# EAGLE design dc26-dev-board (EAGLE 8.6.0)

## Sheet 1 of 7
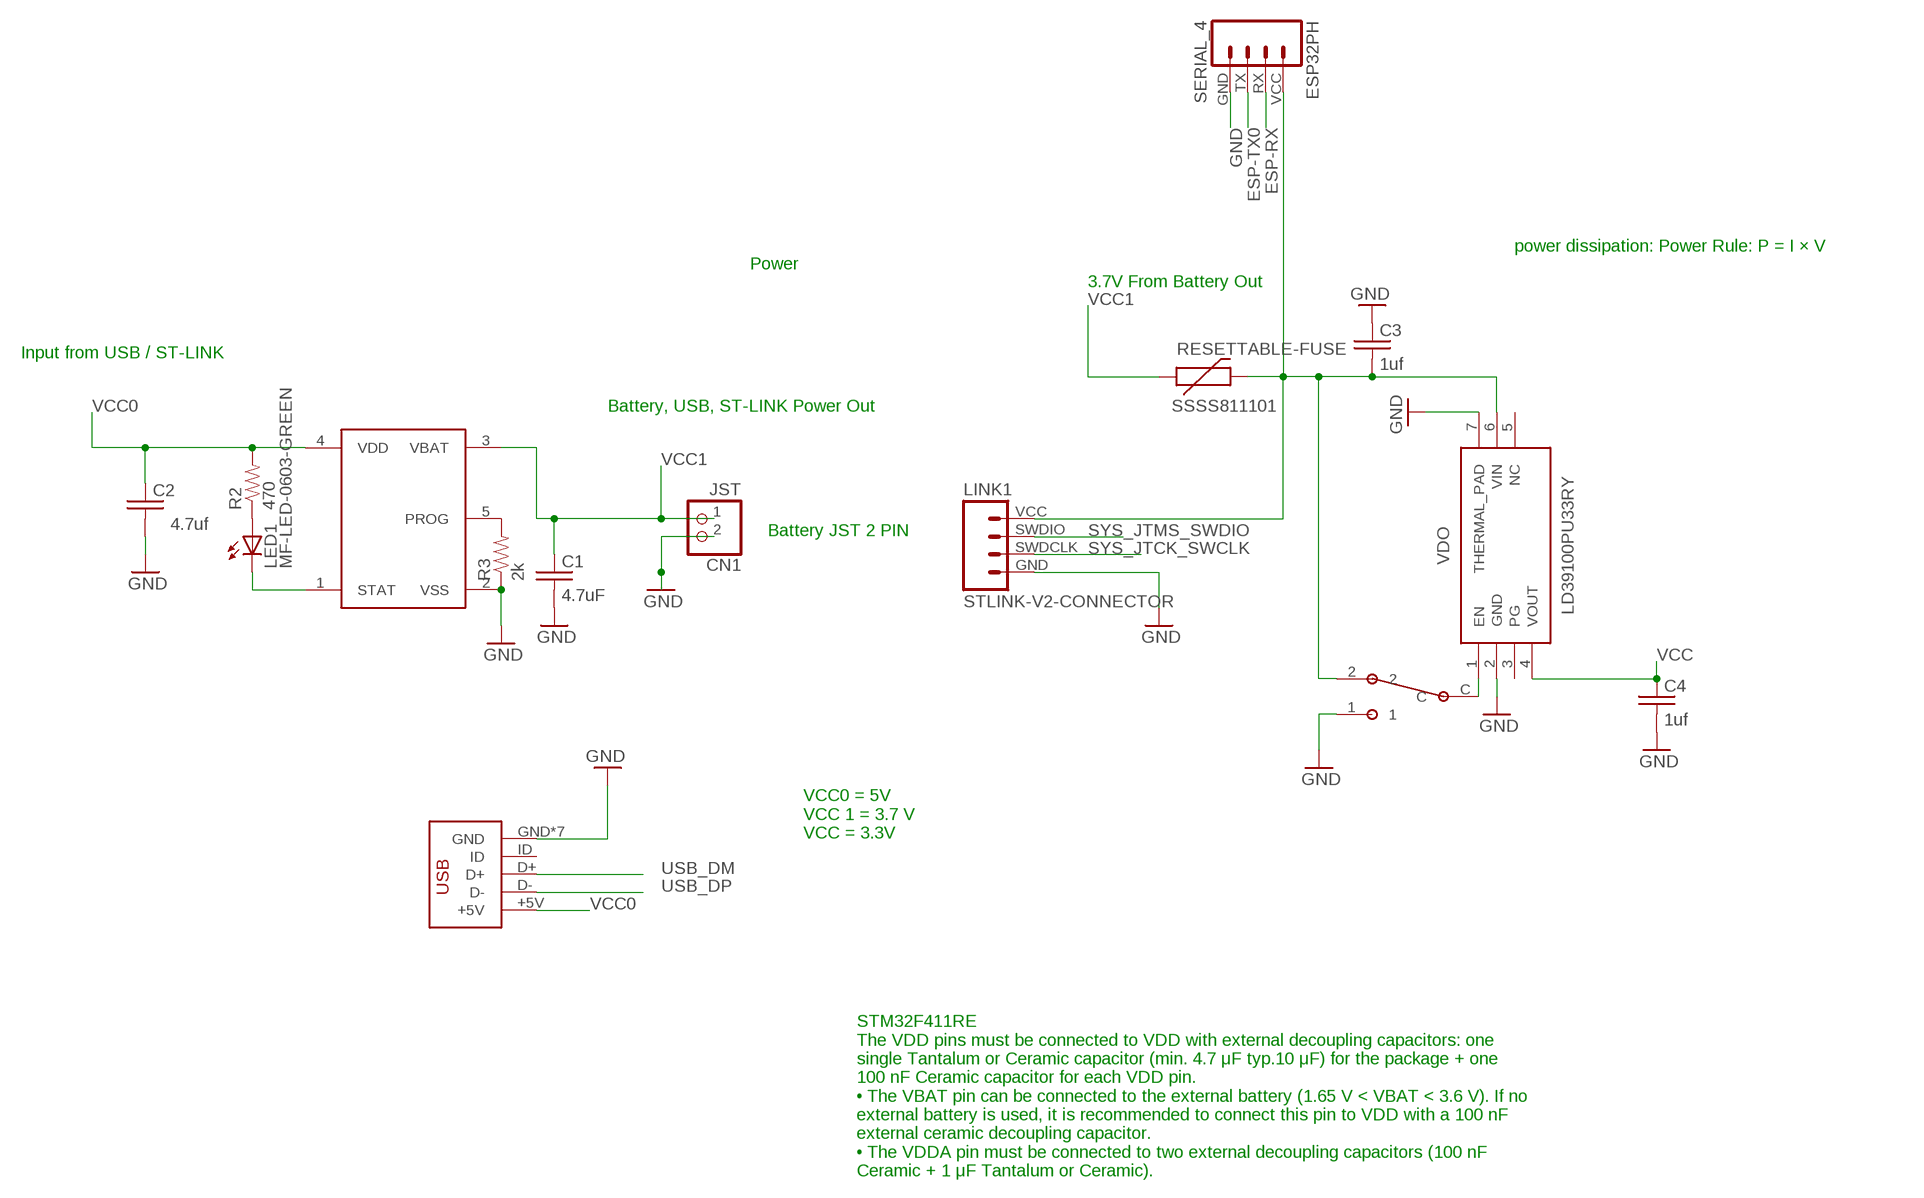
[diagram p0: schematic, sheet 1]

### Parts
C1  4.7uF  C-USC0805  [C0805]
C2  4.7uf  C-USC0805  [C0805]
C3  1uf  C-USC0805  [C0805]
C4  1uf  C-USC0805  [C0805]
CHARGING_CIRCUT  MCP73831  DS21984E  [SOT23-5]
CN1  JST  JST_2PIN-THM-RA  [JST-PH-2-THM-RA]
ESP32PH  SERIAL_4  [SERIAL_HEADER_4]
LED1  MF-LED-0603-GREEN  LED1206  [LED-1206]
LINK1  STLINK-V2-CONNECTOR  [1X04]
P1  SSSS811101  SWITCH_SPDT  [SPDT_SSAJ120100]
R2  470  RESISTOR0805-RES  [0805]
R3  2k  RESISTOR0805-RES  [0805]
RESETTABLE-FUSE  SSSS811101  PTCSMD  [PTC-1206]
USB  DX4R005JJ2DX4R005JJ2  [DX4R005JJ2]
VDO  LD39100PU33RY  [SON95P300X300X90-7N]

### Nets
ESP-RX: ESP32PH.RX ; also sheet 4
ESP-TX0: ESP32PH.TX ; also sheet 4
GND: C1.2 C2.2 C3.1 C4.2 CHARGING_CIRCUT.2(VSS) CN1.2 ESP32PH.GND LINK1.GND P1.1 R3.1 USB.GND USB.P$6(GND) USB.P$7(GND) USB.P$8(GND) USB.P$9(GND) USB.P$10(GND) USB.P$11(GND) VDO.2(GND) VDO.7(THERMAL_PAD) ; also sheet 2,3,4,5
N$1: LED1.A R2.1
N$2: CHARGING_CIRCUT.5(PROG) R3.2
N$3: CHARGING_CIRCUT.1(STAT) LED1.C
SYS_JTCK_SWCLK: LINK1.SWDCLK ; also sheet 2
SYS_JTMS_SWDIO: LINK1.SWDIO ; also sheet 2
USB_DM: USB.D+ ; also sheet 2
USB_DP: USB.D- ; also sheet 2
VCC: C4.1 VDO.4(VOUT) ; also sheet 2,4,5
VCC0: C2.1 CHARGING_CIRCUT.4(VDD) R2.2 USB.+5V
VCC1: C1.1 CHARGING_CIRCUT.3(VBAT) CN1.1 RESETTABLE-FUSE.1 ; also sheet 3
VIN: C3.2 ESP32PH.VCC LINK1.VCC P1.2 RESETTABLE-FUSE.2 VDO.6(VIN)
VIN-EN: P1.C VDO.1(EN)
Unconnected: USB.ID VDO.3(PG) VDO.5(NC)

### Notes on the sheet
- power dissipation: Power Rule: P = I × V
- Power
- 3.7V From Battery Out
- Input from USB / ST-LINK
- Battery, USB, ST-LINK Power Out
- Battery JST 2 PIN
- VCC0 = 5V
  VCC 1 = 3.7 V
  VCC = 3.3V
- STM32F411RE
  The VDD pins must be connected to VDD with external decoupling capacitors: one
  single Tantalum or Ceramic capacitor (min. 4.7 μF typ.10 μF) for the package + one
  100 nF Ceramic capacitor for each VDD pin.
  • The VBAT pin can be connected to the external battery (1.65 V < VBAT < 3.6 V). If no
  external battery is used, it is recommended to connect this pin to VDD with a 100 nF
  external ceramic decoupling capacitor.
  • The VDDA pin must be connected to two external decoupling capacitors (100 nF
  Ceramic + 1 μF Tantalum or Ceramic).

## Sheet 2 of 7
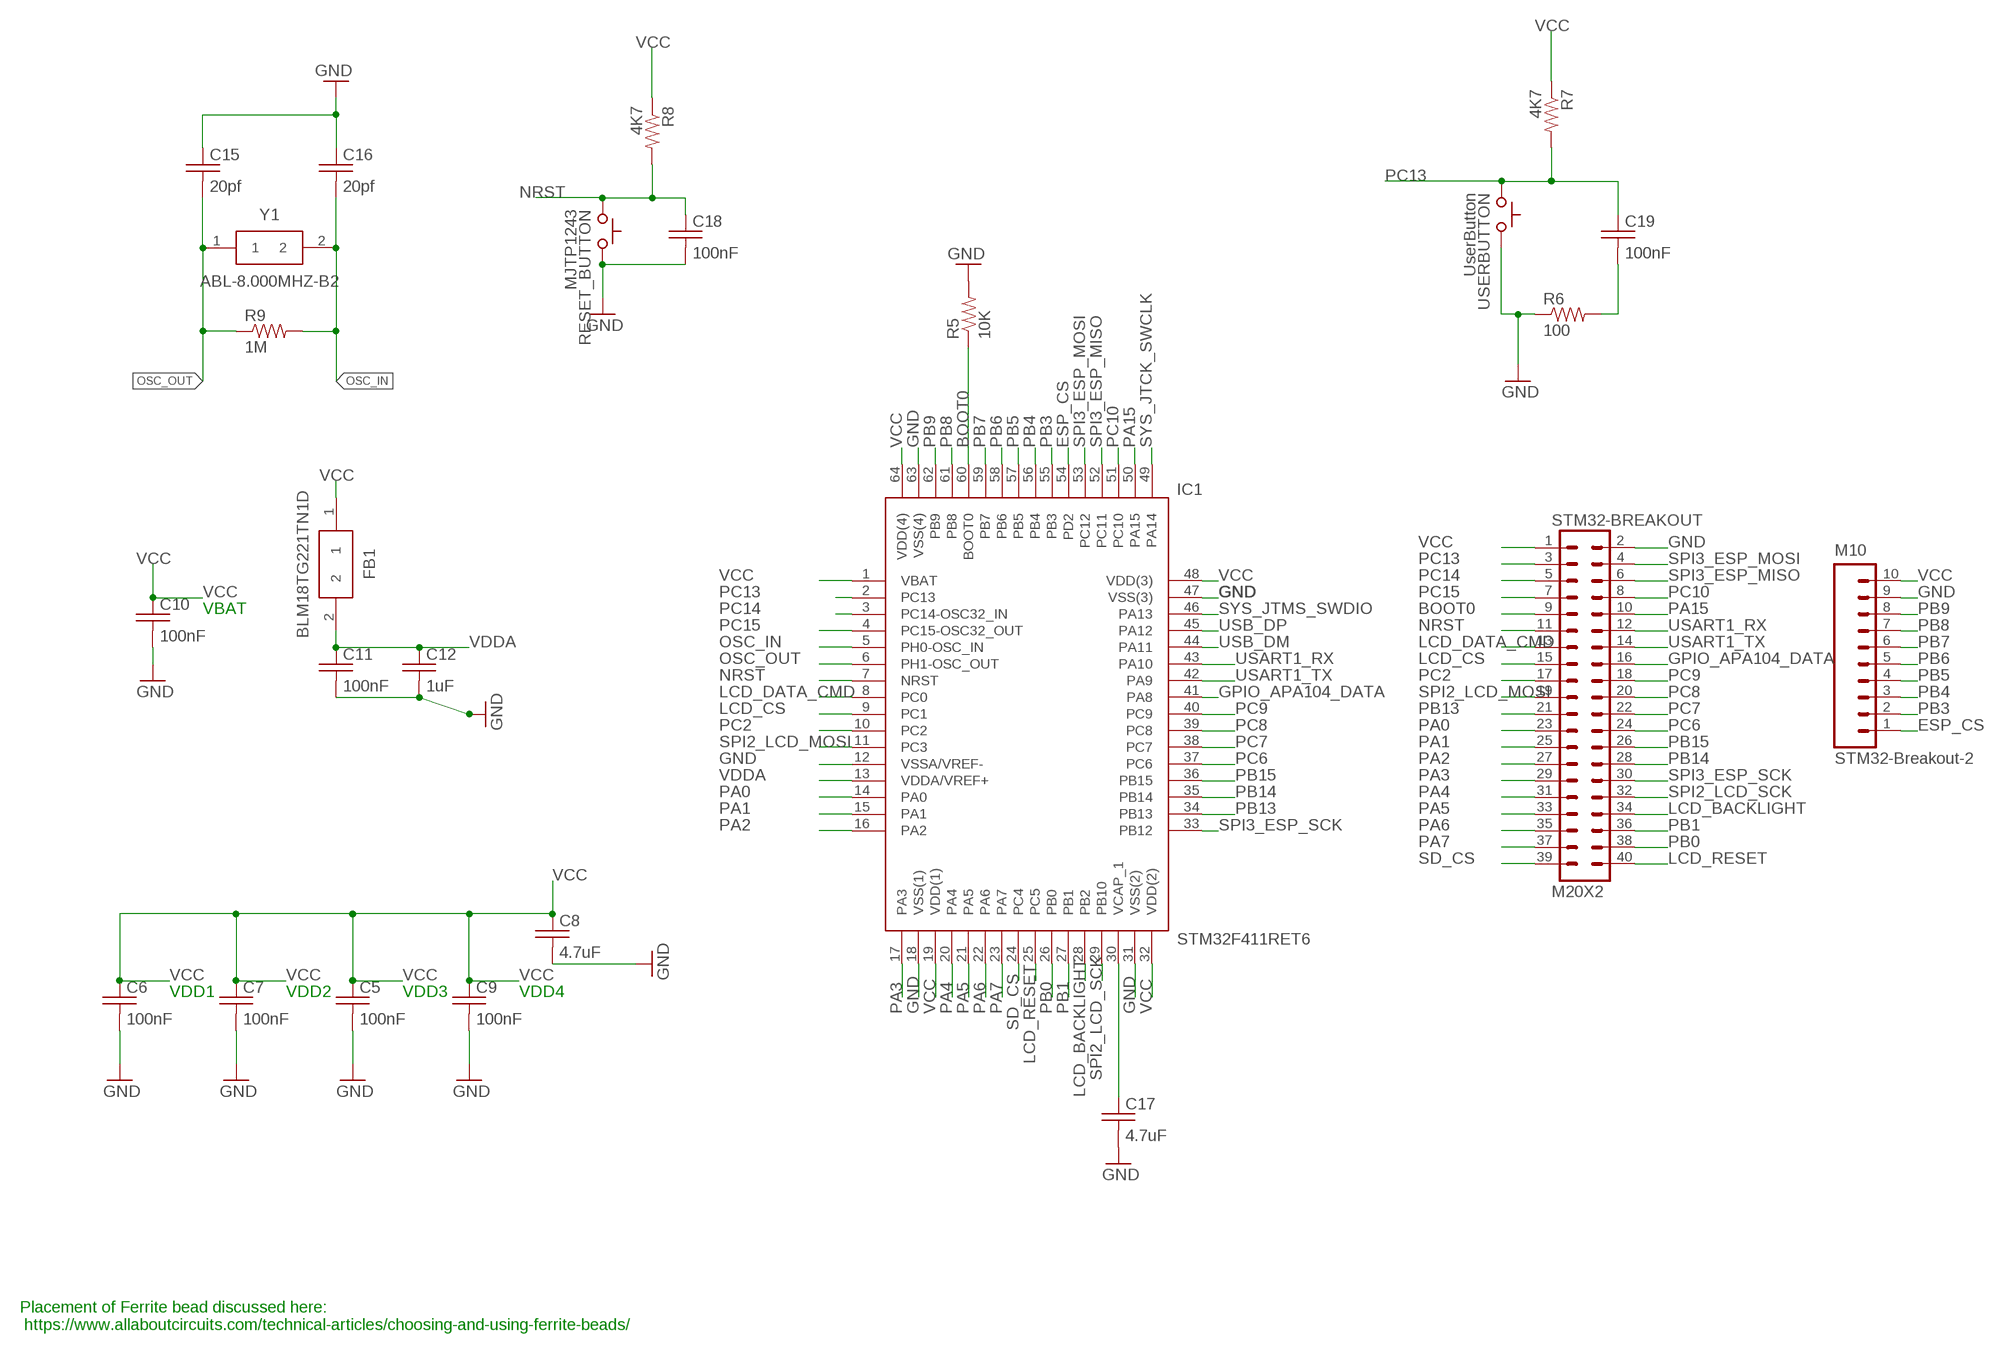
[diagram p1: schematic, sheet 2]

### Parts
C5  100nF  C-USC0805  [C0805]
C6  100nF  C-USC0805  [C0805]
C7  100nF  C-USC0805  [C0805]
C8  4.7uF  C-USC0805  [C0805]
C9  100nF  C-USC0805  [C0805]
C10  100nF  C-USC0805  [C0805]
C11  100nF  C-USC0805  [C0805]
C12  1uF  C-USC0805  [C0805]
C15  20pf  C-USC0805  [C0805]
C16  20pf  C-USC0805  [C0805]
C17  4.7uF  C-USC0805  [C0805]
C18  100nF  C-USC0805  [C0805]
C19  100nF  C-USC0805  [C0805]
FB1  BLM18TG221TN1D  [BEADC1608X75N]
IC1  STM32F411RET6  [QFP50P1200X1200X160-64N]
M10  STM32-Breakout-2  M10SILK_FEMALE_PTH  [1X10]
R5  10K  RESISTOR0805-RES  [0805]
R6  100  RESISTOR0805-RES  [0805]
R7  4K7  RESISTOR0805-RES  [0805]
R8  4K7  RESISTOR0805-RES  [0805]
R9  1M  RESISTOR0805-RES  [0805]
RESET_BUTTON  MJTP1243  SWITCH_TACTILETACTILE-2PIN-NARROW  [TACTILE-2PIN-NARROW]
STM32-BREAKOUT  M20X2  [2X20]
USERBUTTON  UserButton  SWITCH_TACTILETACTILE-2PIN-NARROW  [TACTILE-2PIN-NARROW]
Y1  ABL-8.000MHZ-B2  [HC/49US_(AT49)PTH]

### Nets
BOOT0: IC1.60(BOOT0) R5.1 STM32-BREAKOUT.9
ESP_CS: IC1.54(PD2) M10.1 ; also sheet 4
GND: C5.2 C6.2 C7.2 C8.2 C9.2 C10.2 C11.2 C12.2 C15.1 C16.1 C17.2 C18.2 IC1.12(VSSA/VREF-) IC1.18(VSS(1)) IC1.31(VSS(2)) IC1.47(VSS(3)) IC1.63(VSS(4)) M10.9 R5.2 R6.1 RESET_BUTTON.P$1(A) STM32-BREAKOUT.2 USERBUTTON.P$1(A) ; also sheet 1,3,4,5
GPIO_APA104_DATA: IC1.41(PA8) STM32-BREAKOUT.16 ; also sheet 3
LCD_BACKLIGHT: IC1.28(PB2) STM32-BREAKOUT.34 ; also sheet 5
LCD_CS: IC1.9(PC1) STM32-BREAKOUT.15 ; also sheet 5
LCD_DATA_CMD: IC1.8(PC0) STM32-BREAKOUT.13 ; also sheet 5
LCD_RESET: IC1.25(PC5) STM32-BREAKOUT.40 ; also sheet 5
N$4: C19.2 R6.2
N$20: C17.1 IC1.30(VCAP_1)
NRST: C18.1 IC1.7(NRST) R8.2 RESET_BUTTON.P$2(C) STM32-BREAKOUT.11
OSC_IN: C16.2 IC1.5(PH0-OSC_IN) R9.2 Y1.2
OSC_OUT: C15.2 IC1.6(PH1-OSC_OUT) R9.1 Y1.1
PA0: IC1.14(PA0) STM32-BREAKOUT.23
PA1: IC1.15(PA1) STM32-BREAKOUT.25
PA2: IC1.16(PA2) STM32-BREAKOUT.27
PA3: IC1.17(PA3) STM32-BREAKOUT.29
PA4: IC1.20(PA4) STM32-BREAKOUT.31
PA5: IC1.21(PA5) STM32-BREAKOUT.33
PA6: IC1.22(PA6) STM32-BREAKOUT.35
PA7: IC1.23(PA7) STM32-BREAKOUT.37
PA15: IC1.50(PA15) STM32-BREAKOUT.10
PB0: IC1.26(PB0) STM32-BREAKOUT.38
PB1: IC1.27(PB1) STM32-BREAKOUT.36
PB3: IC1.55(PB3) M10.2
PB4: IC1.56(PB4) M10.3
PB5: IC1.57(PB5) M10.4
PB6: IC1.58(PB6) M10.5
PB7: IC1.59(PB7) M10.6
PB8: IC1.61(PB8) M10.7
PB9: IC1.62(PB9) M10.8
PB13: IC1.34(PB13) STM32-BREAKOUT.21
PB14: IC1.35(PB14) STM32-BREAKOUT.28
PB15: IC1.36(PB15) STM32-BREAKOUT.26
PC2: IC1.10(PC2) STM32-BREAKOUT.17
PC6: IC1.37(PC6) STM32-BREAKOUT.24
PC7: IC1.38(PC7) STM32-BREAKOUT.22
PC8: IC1.39(PC8) STM32-BREAKOUT.20
PC9: IC1.40(PC9) STM32-BREAKOUT.18
PC10: IC1.51(PC10) STM32-BREAKOUT.8
PC13: C19.1 IC1.2(PC13) R7.2 STM32-BREAKOUT.3 USERBUTTON.P$2(C)
PC14: IC1.3(PC14-OSC32_IN) STM32-BREAKOUT.5
PC15: IC1.4(PC15-OSC32_OUT) STM32-BREAKOUT.7
SD_CS: IC1.24(PC4) STM32-BREAKOUT.39 ; also sheet 5
SPI2_LCD_MOSI: IC1.11(PC3) STM32-BREAKOUT.19 ; also sheet 5
SPI2_LCD_SCK: IC1.29(PB10) STM32-BREAKOUT.32 ; also sheet 5
SPI3_ESP_MISO: IC1.52(PC11) STM32-BREAKOUT.6 ; also sheet 4,5
SPI3_ESP_MOSI: IC1.53(PC12) STM32-BREAKOUT.4 ; also sheet 4,5
SPI3_ESP_SCK: IC1.33(PB12) STM32-BREAKOUT.30 ; also sheet 4,5
SYS_JTCK_SWCLK: IC1.49(PA14) ; also sheet 1
SYS_JTMS_SWDIO: IC1.46(PA13) ; also sheet 1
USART1_RX: IC1.43(PA10) STM32-BREAKOUT.12
USART1_TX: IC1.42(PA9) STM32-BREAKOUT.14
USB_DM: IC1.44(PA11) ; also sheet 1
USB_DP: IC1.45(PA12) ; also sheet 1
VCC: C5.1 C6.1 C7.1 C8.1 C9.1 C10.1 FB1.1 IC1.1(VBAT) IC1.19(VDD(1)) IC1.32(VDD(2)) IC1.48(VDD(3)) IC1.64(VDD(4)) M10.10 R7.1 R8.1 STM32-BREAKOUT.1 ; also sheet 1,4,5
VDDA: C11.1 C12.1 FB1.2 IC1.13(VDDA/VREF+)

### Notes on the sheet
- VBAT
- VDD1 | VDD2 | VDD3 | VDD4
- Placement of Ferrite bead discussed here: 
   https://www.allaboutcircuits.com/technical-articles/choosing-and-using-ferrite-beads/

## Sheet 3 of 7
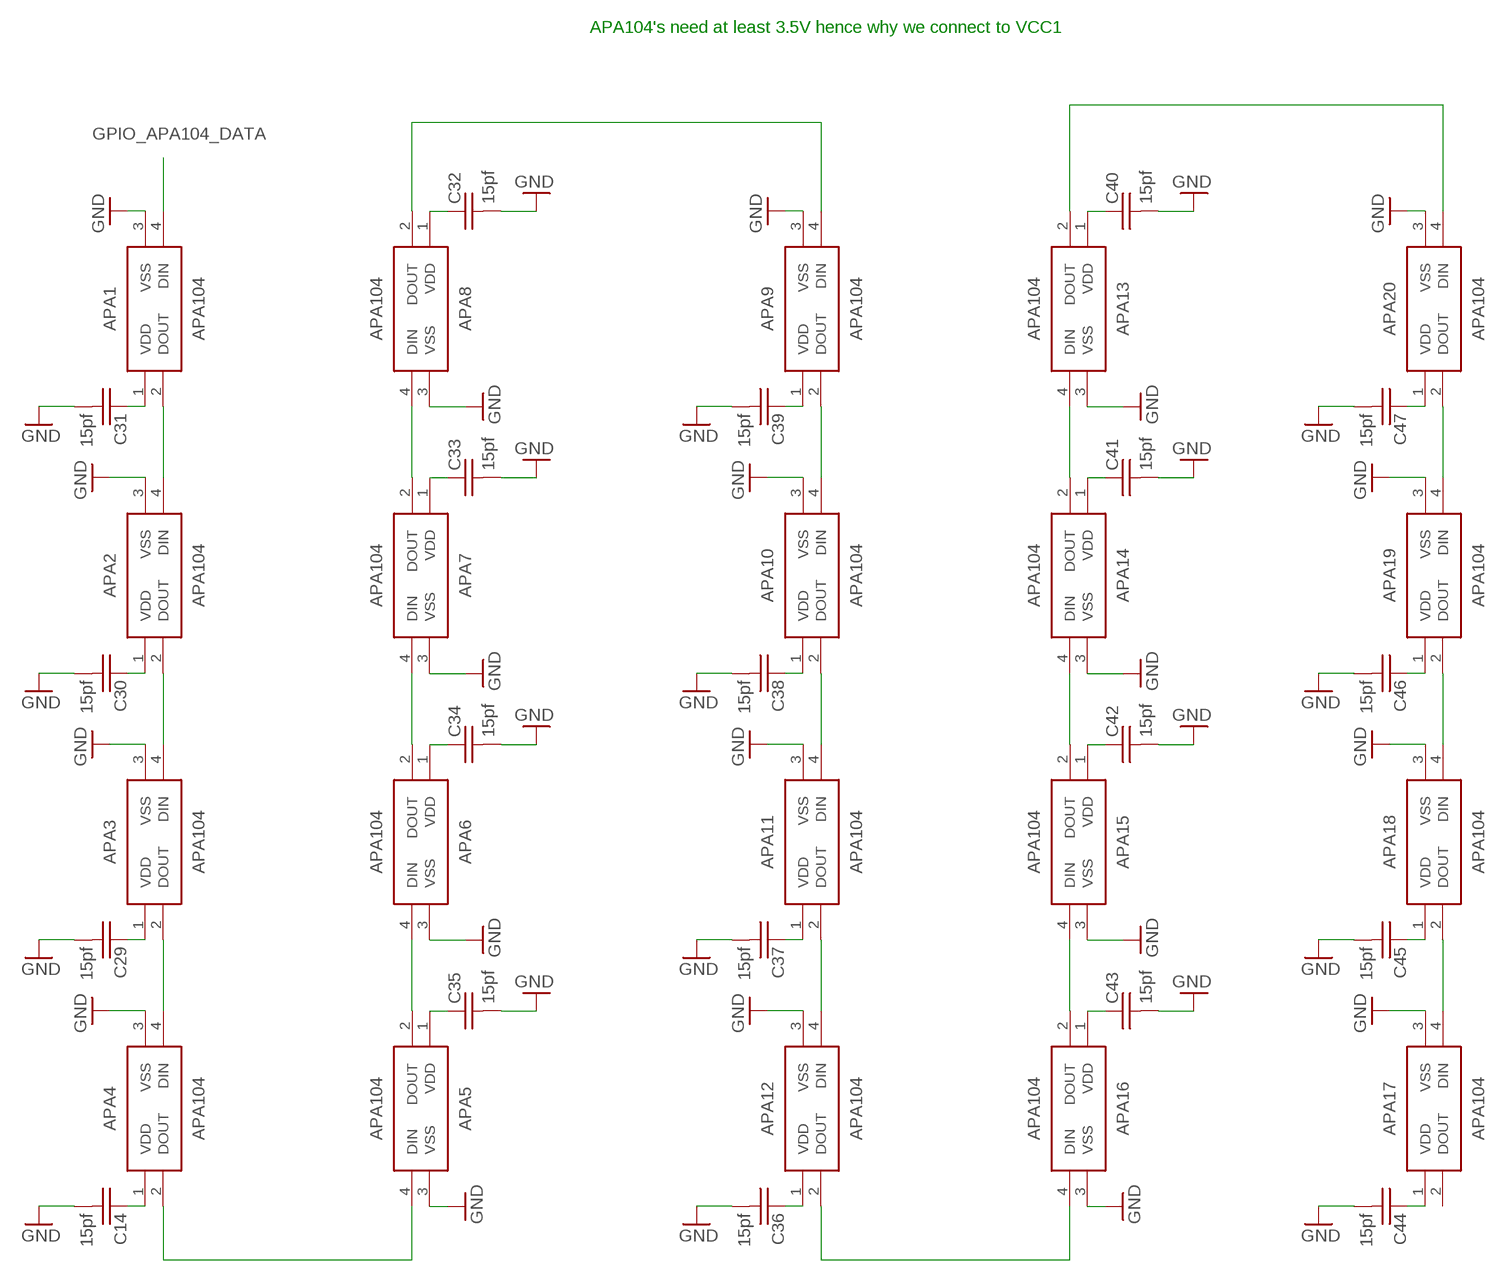
[diagram p2: schematic, sheet 3]

### Parts
APA1  APA104  [APA104]
APA2  APA104  [APA104]
APA3  APA104  [APA104]
APA4  APA104  [APA104]
APA5  APA104  [APA104]
APA6  APA104  [APA104]
APA7  APA104  [APA104]
APA8  APA104  [APA104]
APA9  APA104  [APA104]
APA10  APA104  [APA104]
APA11  APA104  [APA104]
APA12  APA104  [APA104]
APA13  APA104  [APA104]
APA14  APA104  [APA104]
APA15  APA104  [APA104]
APA16  APA104  [APA104]
APA17  APA104  [APA104]
APA18  APA104  [APA104]
APA19  APA104  [APA104]
APA20  APA104  [APA104]
C14  15pf  C-USC0805  [C0805]
C29  15pf  C-USC0805  [C0805]
C30  15pf  C-USC0805  [C0805]
C31  15pf  C-USC0805  [C0805]
C32  15pf  C-USC0805  [C0805]
C33  15pf  C-USC0805  [C0805]
C34  15pf  C-USC0805  [C0805]
C35  15pf  C-USC0805  [C0805]
C36  15pf  C-USC0805  [C0805]
C37  15pf  C-USC0805  [C0805]
C38  15pf  C-USC0805  [C0805]
C39  15pf  C-USC0805  [C0805]
C40  15pf  C-USC0805  [C0805]
C41  15pf  C-USC0805  [C0805]
C42  15pf  C-USC0805  [C0805]
C43  15pf  C-USC0805  [C0805]
C44  15pf  C-USC0805  [C0805]
C45  15pf  C-USC0805  [C0805]
C46  15pf  C-USC0805  [C0805]
C47  15pf  C-USC0805  [C0805]

### Nets
GND: APA1.3(VSS) APA2.3(VSS) APA3.3(VSS) APA4.3(VSS) APA5.3(VSS) APA6.3(VSS) APA7.3(VSS) APA8.3(VSS) APA9.3(VSS) APA10.3(VSS) APA11.3(VSS) APA12.3(VSS) APA13.3(VSS) APA14.3(VSS) APA15.3(VSS) APA16.3(VSS) APA17.3(VSS) APA18.3(VSS) APA19.3(VSS) APA20.3(VSS) C14.2 C29.2 C30.2 C31.2 C32.2 C33.2 C34.2 C35.2 C36.2 C37.2 C38.2 C39.2 C40.2 C41.2 C42.2 C43.2 C44.2 C45.2 C46.2 C47.2 ; also sheet 1,2,4,5
GPIO_APA104_DATA: APA1.4(DIN) ; also sheet 2
N$5: APA1.2(DOUT) APA2.4(DIN)
N$7: APA2.2(DOUT) APA3.4(DIN)
N$8: APA3.2(DOUT) APA4.4(DIN)
N$9: APA5.2(DOUT) APA6.4(DIN)
N$10: APA6.2(DOUT) APA7.4(DIN)
N$11: APA7.2(DOUT) APA8.4(DIN)
N$12: APA9.2(DOUT) APA10.4(DIN)
N$13: APA10.2(DOUT) APA11.4(DIN)
N$14: APA11.2(DOUT) APA12.4(DIN)
N$15: APA15.4(DIN) APA16.2(DOUT)
N$16: APA14.4(DIN) APA15.2(DOUT)
N$17: APA13.4(DIN) APA14.2(DOUT)
N$18: APA19.4(DIN) APA20.2(DOUT)
N$19: APA18.4(DIN) APA19.2(DOUT)
N$21: APA17.4(DIN) APA18.2(DOUT)
N$22: APA4.2(DOUT) APA5.4(DIN)
N$23: APA8.2(DOUT) APA9.4(DIN)
N$24: APA12.2(DOUT) APA16.4(DIN)
N$25: APA13.2(DOUT) APA20.4(DIN)
VCC1: APA1.1(VDD) APA2.1(VDD) APA3.1(VDD) APA4.1(VDD) APA5.1(VDD) APA6.1(VDD) APA7.1(VDD) APA8.1(VDD) APA9.1(VDD) APA10.1(VDD) APA11.1(VDD) APA12.1(VDD) APA13.1(VDD) APA14.1(VDD) APA15.1(VDD) APA16.1(VDD) APA17.1(VDD) APA18.1(VDD) APA19.1(VDD) APA20.1(VDD) C14.1 C29.1 C30.1 C31.1 C32.1 C33.1 C34.1 C35.1 C36.1 C37.1 C38.1 C39.1 C40.1 C41.1 C42.1 C43.1 C44.1 C45.1 C46.1 C47.1 ; also sheet 1
Unconnected: APA17.2(DOUT)

### Notes on the sheet
- APA104's need at least 3.5V hence why we connect to VCC1

## Sheet 4 of 7
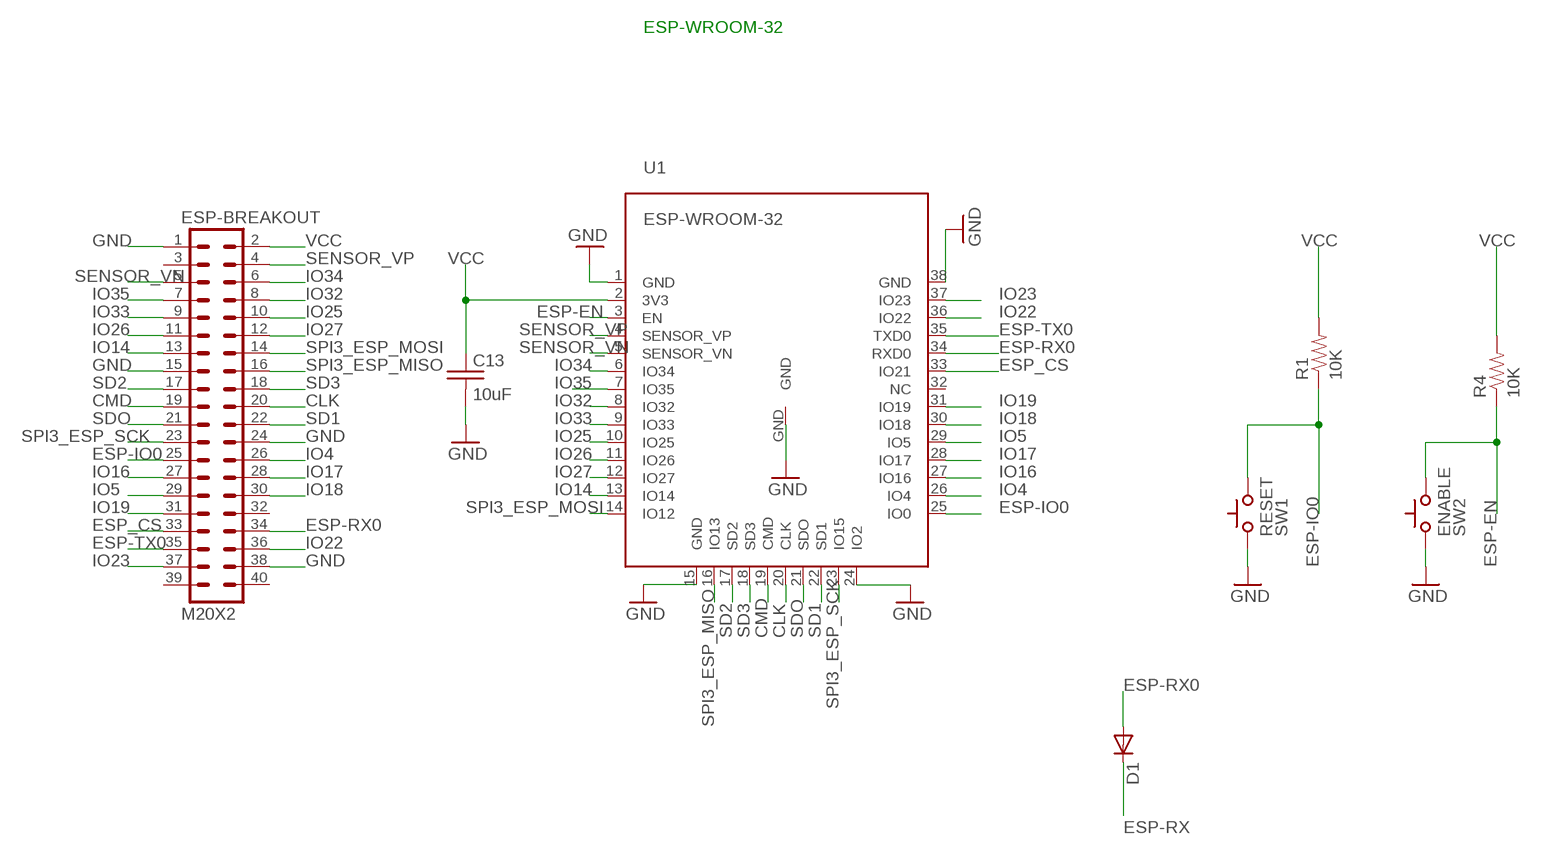
[diagram p3: schematic, sheet 4]

### Parts
C13  10uF  C-USC0805  [C0805]
D1  DIODESOD  [SOD-323]
ENABLE  SW2  SWITCH_TACTILETACTILE-2PIN-NARROW  [TACTILE-2PIN-NARROW]
ESP-BREAKOUT  M20X2  [2X20]
R1  10K  RESISTOR0805-RES  [0805]
R4  10K  RESISTOR0805-RES  [0805]
RESET  SW1  SWITCH_TACTILETACTILE-2PIN-NARROW  [TACTILE-2PIN-NARROW]
U1  ESP-WROOM-32  [ESP-WROOM-32]

### Nets
CLK: ESP-BREAKOUT.20 U1.20(CLK)
CMD: ESP-BREAKOUT.19 U1.19(CMD)
ESP-EN: ENABLE.P$1(A) R4.1 U1.3(EN)
ESP-IO0: ESP-BREAKOUT.25 R1.1 RESET.P$1(A) U1.25(IO0)
ESP-RX: D1.1(C) ; also sheet 1
ESP-RX0: D1.2(A) ESP-BREAKOUT.34 U1.34(RXD0)
ESP-TX0: ESP-BREAKOUT.35 U1.35(TXD0) ; also sheet 1
ESP_CS: ESP-BREAKOUT.33 U1.33(IO21) ; also sheet 2
GND: C13.2 ENABLE.P$2(C) ESP-BREAKOUT.1 ESP-BREAKOUT.15 ESP-BREAKOUT.24 ESP-BREAKOUT.38 RESET.P$2(C) U1.1(GND) U1.15(GND) U1.24(IO2) U1.38(GND) U1.GND ; also sheet 1,2,3,5
IO4: ESP-BREAKOUT.26 U1.26(IO4)
IO5: ESP-BREAKOUT.29 U1.29(IO5)
IO14: ESP-BREAKOUT.13 U1.13(IO14)
IO16: ESP-BREAKOUT.27 U1.27(IO16)
IO17: ESP-BREAKOUT.28 U1.28(IO17)
IO18: ESP-BREAKOUT.30 U1.30(IO18)
IO19: ESP-BREAKOUT.31 U1.31(IO19)
IO22: ESP-BREAKOUT.36 U1.36(IO22)
IO23: ESP-BREAKOUT.37 U1.37(IO23)
IO25: ESP-BREAKOUT.10 U1.10(IO25)
IO26: ESP-BREAKOUT.11 U1.11(IO26)
IO27: ESP-BREAKOUT.12 U1.12(IO27)
IO32: ESP-BREAKOUT.8 U1.8(IO32)
IO33: ESP-BREAKOUT.9 U1.9(IO33)
IO34: ESP-BREAKOUT.6 U1.6(IO34)
IO35: ESP-BREAKOUT.7 U1.7(IO35)
SD1: ESP-BREAKOUT.22 U1.22(SD1)
SD2: ESP-BREAKOUT.17 U1.17(SD2)
SD3: ESP-BREAKOUT.18 U1.18(SD3)
SDO: ESP-BREAKOUT.21 U1.21(SDO)
SENSOR_VN: ESP-BREAKOUT.5 U1.5(SENSOR_VN)
SENSOR_VP: ESP-BREAKOUT.4 U1.4(SENSOR_VP)
SPI3_ESP_MISO: ESP-BREAKOUT.16 U1.16(IO13) ; also sheet 2,5
SPI3_ESP_MOSI: ESP-BREAKOUT.14 U1.14(IO12) ; also sheet 2,5
SPI3_ESP_SCK: ESP-BREAKOUT.23 U1.23(IO15) ; also sheet 2,5
VCC: C13.1 ESP-BREAKOUT.2 R1.2 R4.2 U1.2(3V3) ; also sheet 1,2,5
Unconnected: ESP-BREAKOUT.3 ESP-BREAKOUT.32 ESP-BREAKOUT.39 ESP-BREAKOUT.40 U1.32(NC)

### Notes on the sheet
- ESP-WROOM-32

## Sheet 5 of 7
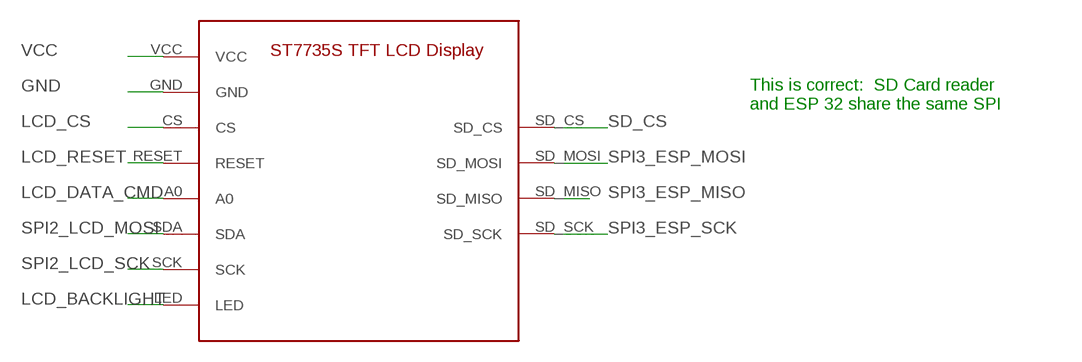
[diagram p4: schematic, sheet 5]

### Parts
U$1  ST7735S_LCD_MODULE  [ST7735S_LCD_DISPLAY]

### Nets
GND: U$1.GND ; also sheet 1,2,3,4
LCD_BACKLIGHT: U$1.LED ; also sheet 2
LCD_CS: U$1.CS ; also sheet 2
LCD_DATA_CMD: U$1.A0 ; also sheet 2
LCD_RESET: U$1.RESET ; also sheet 2
SD_CS: U$1.SD_CS ; also sheet 2
SPI2_LCD_MOSI: U$1.SDA ; also sheet 2
SPI2_LCD_SCK: U$1.SCK ; also sheet 2
SPI3_ESP_MISO: U$1.SD_MISO ; also sheet 2,4
SPI3_ESP_MOSI: U$1.SD_MOSI ; also sheet 2,4
SPI3_ESP_SCK: U$1.SD_SCK ; also sheet 2,4
VCC: U$1.VCC ; also sheet 1,2,4

### Notes on the sheet
- This is correct:  SD Card reader
  and ESP 32 share the same SPI

## Sheet 6 of 7
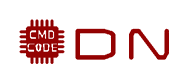
[diagram p5: schematic, sheet 6]

### Parts
U$2  CMD_C0DE_LOGO  [CMD_C0DE_LOGO]
U$3  DARKNET_DD  [DARKNET_D]
U$4  DARKNET_NN  [DARKNET_N]

## Sheet 7 of 7
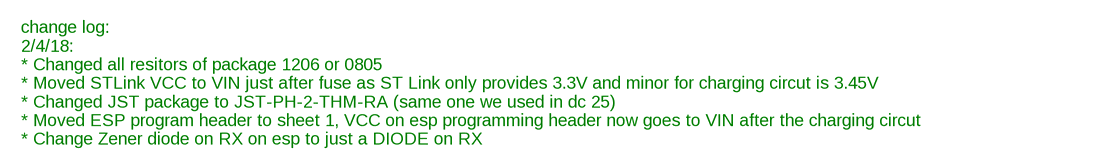
[diagram p6: schematic, sheet 7]

### Notes on the sheet
- change log:
  2/4/18:  
  * Changed all resitors of package 1206 or 0805
  * Moved STLink VCC to VIN just after fuse as ST Link only provides 3.3V and minor for charging circut is 3.45V
  * Changed JST package to JST-PH-2-THM-RA (same one we used in dc 25)
  * Moved ESP program header to sheet 1, VCC on esp programming header now goes to VIN after the charging circut
  * Change Zener diode on RX on esp to just a DIODE on RX

## Library data of the parts
APA1-APA20 = APA104:APA104: APA104 LED CHIP Source: Datasheet <http://www.ledlightinghut.com/files/APA104%20Datasheet.pdf>; DESCRIPTION: APA104 LED Chip; HEIGHT: mm; MANUFACTURER_NAME: Worldsemi; MANUFACTURER_PART_NUMBER: APA104; SUPPLIER_NAME: RS
C1-C19 C29-C47 = dc-26:C-US: CAPACITOR, American symbol
CHARGING_CIRCUT = dc-26:DS21984E
CN1 = dc-26:JST_2PIN: JST 2-Pin Connectors of various flavors SMT-RA (S2B-PH-SM4) 4UConnector #17311 SMT (B2B-PH-SM4) THM-RA (S2B-PH) THM (B2B-PH)
D1 = dc-26:DIODE: Diode These are standard reverse protection diodes and small signal diodes. SMA package can handle up to about 1A. SOD-323 can handle about 200mA. What the SOD-323 package when ordering, there are some mfgs out there that are 5-pin packages.; PROD_ID: DIO-09646
ENABLE RESET RESET_BUTTON USERBUTTON = dc-26:SWITCH_TACTILE
ESP32PH = dc-26:SERIAL_4
ESP-BREAKOUT STM32-BREAKOUT = dc-26:M20X2: 0.1" spaced headers
FB1 = dc-26:BLM18TG221TN1D: Ferrite bead SMD 0603 220R Murata Ferrite Bead (Chip Ferrite Bead), 1.6 x 0.8 x 0.6mm (0603), 1000 impedance at 100 MHz <https://componentsearchengine.com/Images/3/BLM18TG221TN1D.jpg> Source: Datasheet <http://www.murata.com/~/media/webrenewal/support/library/catalog/products/emc/emifil/c31e.ashx?la=en-gb>; DESCRIPTION: Ferrite bead SMD 0603 220R Murata Ferrite Bead (Chip Ferrite Bead), 1.6 x 0.8 x 0.6mm (0603), 1000 impedance at 100 MHz; HEIGHT: 0.75mm; MANUFACTURER_NAME: Murata Electronics; MANUFACTURER_PART_NUMBER: BLM18TG221TN1D; RS_PART_NUMBER: 6197526; SUPPLIER_NAME: RS
IC1 = STM32F411RET6:STM32F411RET6: 32-Bit MCU+DSP 512K Flash 100MHz LQFP64 STMicroelectronics STM32F411RET6, 32bit ARM Cortex M4 MCU, 100MHz, 512 kB Flash, 64-Pin LQFP <https://componentsearchengine.com/Images/1/STM32F411RET6.jpg> Source: Datasheet <http://www.farnell.com/datasheets/2042639.pdf>; DESCRIPTION: 32-Bit MCU+DSP 512K Flash 100MHz LQFP64 STMicroelectronics STM32F411RET6, 32bit ARM Cortex M4 MCU, 100MHz, 512 kB Flash, 64-Pin LQFP; HEIGHT: 1.6mm; MANUFACTURER_NAME: STMicroelectronics; MANUFACTURER_PART_NUMBER: STM32F411RET6; RS_PART_NUMBER: 1106617P; SUPPLIER_NAME: RS
LED1 = dc-26:LED: LEDs Standard schematic elements and footprints for 5mm, 3mm, 1206, and 0603 sized LEDs. 5mm - Spark Fun Electronics SKU : COM-00529 (and others)
LINK1 = dc-26:STLINK-V2-CONNECTOR
M10 = dc-26:M10: Header 10 Standard 10-pin 0.1" header. Use with straight break away headers (SKU : PRT-00116), right angle break away headers (PRT-00553), swiss pins (PRT-00743), machine pins (PRT-00117), and female headers (PRT-00115).; PROD_ID: CONN-11563
P1 = dc-26:SWITCH_SPDT
R1-R9 = dc-26:RESISTOR: Resistor Basic schematic elements and footprints for 0603, 1206, and PTH resistors.
RESETTABLE-FUSE = dc-26:PTC: Resettable Fuse PTC Resettable Fuse. Spark Fun Electronics SKU : COM-08357; PROD_ID: RES-11150
U1 = dc-26:ESP-WROOM-32
U$1 = dc-26:ST7735S_LCD_MODULE
U$2 = dc-26:CMD_C0DE_LOGO
U$3 = dc-26:DARKNET_D
U$4 = dc-26:DARKNET_N
USB = dc-26:DX4R005JJ2
VDO = dc-26:LD39100PU33RY: LDO Voltage Regulators 1 A low quiescent current low noise voltage regulator <https://componentsearchengine.com/Images/9/LD39100PU33RY.jpg> Source: Datasheet <http://www.st.com/content/ccc/resource/technical/document/datasheet/72/02/e5/ee/df/36/40/5e/CD00233788.pdf/files/CD00233788.pdf/jcr:content/translations/en.CD00233788.pdf>; DESCRIPTION: LDO Voltage Regulators 1 A low quiescent current low noise voltage regulator; HEIGHT: 0.9mm; MANUFACTURER_NAME: STMicroelectronics; MANUFACTURER_PART_NUMBER: LD39100PU33RY; SUPPLIER_NAME: RS
Y1 = ABL-8.000MHZ-B2:ABL-8.000MHZ-B2: ABRACON - ABL-8.000MHZ-B2 - CRYSTAL, 8MHZ, 18PF, HC-49US <https://componentsearchengine.com/Images/9/ABL-8.000MHZ-B2.jpg> Source: Datasheet <http://www.abracon.com/Resonators/ABL.pdf>; DESCRIPTION: ABRACON - ABL-8.000MHZ-B2 - CRYSTAL, 8MHZ, 18PF, HC-49US; HEIGHT: mm; MANUFACTURER_NAME: ABRACON; MANUFACTURER_PART_NUMBER: ABL-8.000MHZ-B2; SUPPLIER_NAME: RS

## Board
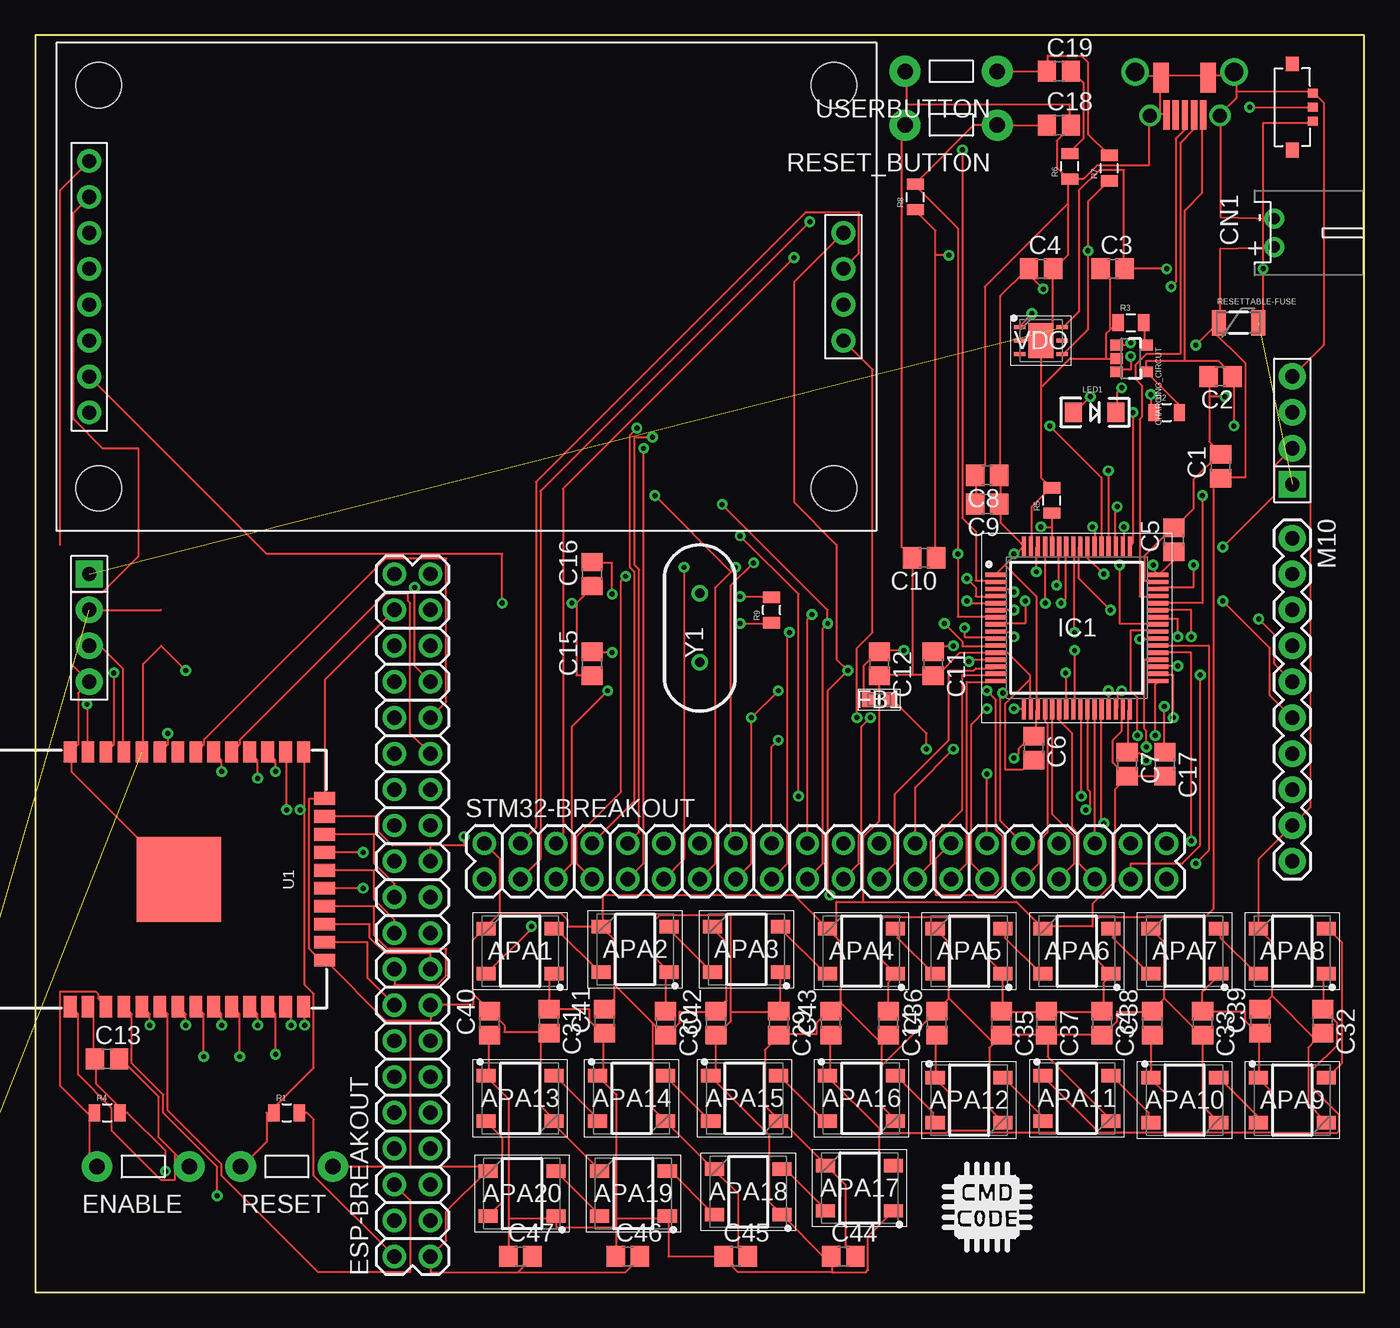
[diagram p7: board, top side]
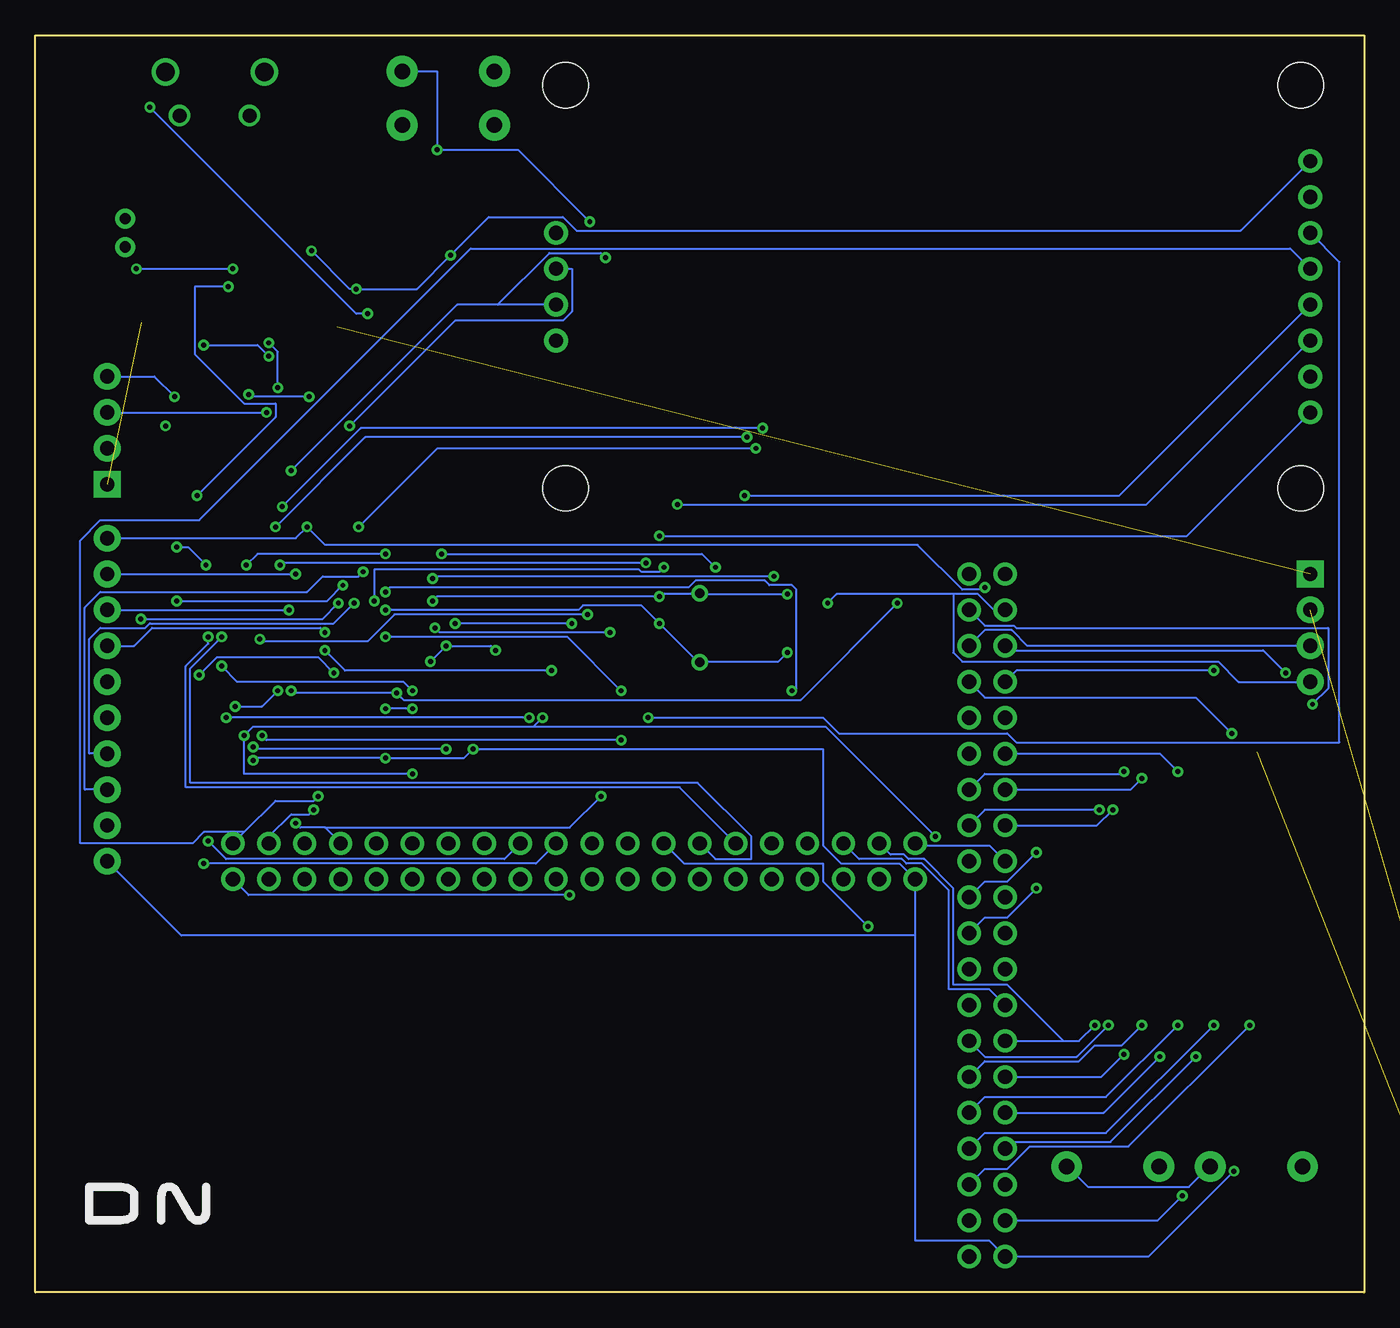
[diagram p8: board, bottom side, seen from below]

Size 93.98 x 88.9 mm. Coordinates in mm from the lower left corner, seen from the top.
Outline: 0,0 93.98,0 93.98,88.9 0,88.9 0,0
Copper layers (1*16): Top 0.035mm / dielectric 1.5mm / Bottom 0.035mm
Design rules "default": minimum track width 6mil, minimum drill 0.35mm, track to track 6mil, track to pad 6mil, pad to pad 6mil, via to via 6mil, smd to smd 6mil, copper to edge 40mil, drill to drill 6mil, minimum pad ring 10mil, minimum via ring 8mil, stop-mask expansion 4mil, vias tented up to drill 0mil, thermal gap 10mil

### Footprints (pad centres in the part's own frame; a part is rotated, then mirrored left to right if it is on the bottom)
APA104 = smd 1.35 x 0.95: 1 -2.4,1.6; 2 -2.4,-1.6; 3 2.4,-1.6; 4 2.4,1.6
C0805 = smd 1.3 x 1.5: 1 -0.85,0; 2 0.85,0
SOT23-5 = smd 0.75 x 0.9: 1 -0.95,-1; 2 0,-1; 3 0.95,-1; 4 0.95,1.1; 5 -0.95,1.1
JST-PH-2-THM-RA = drill 0.8 pad 1.422: 1 1,0; 2 -1,0
SOD-323 = smd 0.63 x 0.83: 1 -1.15,0; 2 1.15,0
TACTILE-2PIN-NARROW = drill 1.1 pad 2.184: P$1 3.264,0; P$2 -3.264,0
SERIAL_HEADER_4 = drill 1.016 pad 1.88: GND 3.81,0; RX -1.27,0; TX 1.27,0 | drill 1.016 pad 1.88 square: VCC -3.81,0
2X20 = drill 1.016 pad 1.651: 1 -24.13,-1.27; 2 -24.13,1.27; 3 -21.59,-1.27; 4 -21.59,1.27; 5 -19.05,-1.27; 6 -19.05,1.27; 7 -16.51,-1.27; 8 -16.51,1.27; 9 -13.97,-1.27; 10 -13.97,1.27; 11 -11.43,-1.27; 12 -11.43,1.27; 13 -8.89,-1.27; 14 -8.89,1.27; 15 -6.35,-1.27; 16 -6.35,1.27; 17 -3.81,-1.27; 18 -3.81,1.27; 19 -1.27,-1.27; 20 -1.27,1.27; 21 1.27,-1.27; 22 1.27,1.27; 23 3.81,-1.27; 24 3.81,1.27; 25 6.35,-1.27; 26 6.35,1.27; 27 8.89,-1.27; 28 8.89,1.27; 29 11.43,-1.27; 30 11.43,1.27; 31 13.97,-1.27; 32 13.97,1.27; 33 16.51,-1.27; 34 16.51,1.27; 35 19.05,-1.27; 36 19.05,1.27; 37 21.59,-1.27; 38 21.59,1.27; 39 24.13,-1.27; 40 24.13,1.27
BEADC1608X75N = smd 0.85 x 1: 1 -0.8,0; 2 0.8,0
QFP50P1200X1200X160-64N = smd 1.475 x 0.3: 1 -5.738,3.75; 2 -5.738,3.25; 3 -5.738,2.75; 4 -5.738,2.25; 5 -5.738,1.75; 6 -5.738,1.25; 7 -5.738,0.75; 8 -5.738,0.25; 9 -5.738,-0.25; 10 -5.738,-0.75; 11 -5.738,-1.25; 12 -5.738,-1.75; 13 -5.738,-2.25; 14 -5.738,-2.75; 15 -5.738,-3.25; 16 -5.738,-3.75; 33 5.738,-3.75; 34 5.738,-3.25; 35 5.738,-2.75; 36 5.738,-2.25; 37 5.738,-1.75; 38 5.738,-1.25; 39 5.738,-0.75; 40 5.738,-0.25; 41 5.738,0.25; 42 5.738,0.75; 43 5.738,1.25; 44 5.738,1.75; 45 5.738,2.25; 46 5.738,2.75; 47 5.738,3.25; 48 5.738,3.75 | smd 0.3 x 1.475: 17 -3.75,-5.738; 18 -3.25,-5.738; 19 -2.75,-5.738; 20 -2.25,-5.738; 21 -1.75,-5.738; 22 -1.25,-5.738; 23 -0.75,-5.738; 24 -0.25,-5.738; 25 0.25,-5.738; 26 0.75,-5.738; 27 1.25,-5.738; 28 1.75,-5.738; 29 2.25,-5.738; 30 2.75,-5.738; 31 3.25,-5.738; 32 3.75,-5.738; 49 3.75,5.738; 50 3.25,5.738; 51 2.75,5.738; 52 2.25,5.738; 53 1.75,5.738; 54 1.25,5.738; 55 0.75,5.738; 56 0.25,5.738; 57 -0.25,5.738; 58 -0.75,5.738; 59 -1.25,5.738; 60 -1.75,5.738; 61 -2.25,5.738; 62 -2.75,5.738; 63 -3.25,5.738; 64 -3.75,5.738
LED-1206 = smd 1.2 x 1.4: A -1.5,0; C 1.5,0
1X04 = drill 1.016 pad 1.88: GND 2.54,0; SWDCLK 0,0; SWDIO -2.54,0 | drill 1.016 pad 1.88 square: VCC -5.08,0
1X10 = drill 1.016 pad 1.88: 1 0,0; 2 2.54,0; 3 5.08,0; 4 7.62,0; 5 10.16,0; 6 12.7,0; 7 15.24,0; 8 17.78,0; 9 20.32,0; 10 22.86,0
SPDT_SSAJ120100 = smd 0.635 x 0.7: 1 -1,1.45; 2 1,1.45; C 0,1.45 | smd 1.05 x 0.9: MNT1 -3.05,0; MNT2 3.05,0
0805 = smd 0.8 x 1.2: 1 -0.9,0; 2 0.9,0
PTC-1206 = smd 1 x 1.8: 1 -1.4,0; 2 1.4,0
ESP-WROOM-32 = smd 0.9 x 1.5: 1 7.7,9; 2 6.43,9; 3 5.16,9; 4 3.89,9; 5 2.62,9; 6 1.35,9; 7 0.08,9; 8 -1.19,9; 9 -2.46,9; 10 -3.73,9; 11 -5,9; 12 -6.27,9; 13 -7.54,9; 14 -8.81,9; 25 -8.81,-9; 26 -7.54,-9; 27 -6.27,-9; 28 -5,-9; 29 -3.73,-9; 30 -2.46,-9; 31 -1.19,-9; 32 0.08,-9; 33 1.35,-9; 34 2.62,-9; 35 3.89,-9; 36 5.16,-9; 37 6.43,-9; 38 7.7,-9 | smd 1.5 x 0.9: 15 -10.3,5.715; 16 -10.3,4.445; 17 -10.3,3.175; 18 -10.3,1.905; 19 -10.3,0.635; 20 -10.3,-0.635; 21 -10.3,-1.905; 22 -10.3,-3.175; 23 -10.3,-4.445; 24 -10.3,-5.715 | smd 6 x 6: GND 0,0
ST7735S_LCD_DISPLAY = drill 1 pad 1.676: A0 1.27,-26.67; CS -3.81,-26.67; GND -6.35,-26.67; LED 8.89,-26.67; RESET -1.27,-26.67; SCK 6.35,-26.67; SD_CS -3.81,26.67; SD_MISO 1.27,26.67; SD_MOSI -1.27,26.67; SD_SCK 3.81,26.67; SDA 3.81,-26.67; VCC -8.89,-26.67 | hole 3.2: -14.25,26; 14.25,26; 14.25,-26; -14.25,-26
DX4R005JJ2 = smd 2.1 x 0.45: +5V 0.72,-1.32; D+ 0.72,-0.02; D- 0.72,-0.67; GND 0.72,1.28; ID 0.72,0.63 | smd 2.1 x 1.1: P$6 3.35,1.65; P$8 3.35,-1.65 | drill 1: P$7 0.675,2.45; P$9 0.675,-2.5 | drill 1.3: P$10 3.75,-3.5; P$11 3.75,3.5
SON95P300X300X90-7N = smd 0.8 x 0.3: 1 -1.5,0.95; 2 -1.5,0; 3 -1.5,-0.95; 4 1.5,-0.95; 5 1.5,0; 6 1.5,0.95 | smd 1.75 x 2.5: 7 0,0
HC/49US_(AT49)PTH = drill 0.66 pad 1.1: 1 -2.44,0; 2 2.44,0

### Placement (x,y rotation side)
APA1  34.29,24.13 180 top
APA2  42.42,24.26 180 top
APA3  50.29,24.26 180 top
APA4  58.42,24.13 180 top
APA5  66.04,24.13 180 top
APA6  73.66,24.13 180 top
APA7  81.28,24.13 180 top
APA8  88.9,24.13 180 top
APA9  88.9,13.59 0 top
APA10  81.28,13.59 0 top
APA11  73.66,13.72 0 top
APA12  66.04,13.59 0 top
APA13  34.29,13.72 0 top
APA14  42.16,13.72 0 top
APA15  50.17,13.72 0 top
APA16  58.42,13.72 0 top
APA17  58.29,7.37 180 top
APA18  50.42,7.11 180 top
APA19  42.29,6.98 180 top
APA20  34.42,6.98 180 top
C1  83.82,58.42 90 top
C2  83.82,64.77 180 top
C3  76.2,72.39 0 top
C4  71.12,72.39 0 top
C5  80.52,53.21 90 top
C6  70.61,38.48 270 top
C7  77.22,37.34 270 top
C8  67.31,57.79 180 top
C9  67.31,55.75 180 top
C10  62.87,51.94 180 top
C11  63.5,44.45 270 top
C12  59.69,44.45 270 top
C13  5.08,16.51 0 top
C14  60.33,19.05 270 top
C15  39.37,44.45 90 top
C16  39.37,50.8 90 top
C17  79.88,37.34 270 top
C18  72.39,82.55 0 top
C19  72.39,86.36 0 top
C29  52.58,19.05 270 top
C30  44.58,19.05 270 top
C31  36.32,19.18 270 top
C32  91.06,19.18 270 top
C33  82.55,19.05 270 top
C34  75.44,19.05 270 top
C35  68.33,19.05 270 top
C36  63.75,19.05 90 top
C37  71.5,19.05 270 top
C38  78.99,19.05 90 top
C39  86.61,19.18 90 top
C40  32.13,19.05 90 top
C41  40.26,19.18 90 top
C42  48.13,19.05 90 top
C43  56.26,19.05 90 top
C44  57.15,2.54 0 top
C45  49.53,2.54 0 top
C46  41.91,2.54 0 top
C47  34.29,2.54 0 top
CHARGING_CIRCUT  77.47,66.04 270 top
CN1  87.63,74.93 270 top
D1  -10.16,-3.81 0 top  (outside the outline)
ENABLE  7.62,8.89 180 top
ESP32PH  3.81,46.99 270 top
ESP-BREAKOUT  26.67,26.67 90 top
FB1  59.69,41.91 180 top
IC1  73.66,46.99 0 top
LED1  74.93,62.23 0 top
LINK1  88.9,62.23 90 top
M10  88.9,53.34 270 top
P1  88.9,83.82 270 top
R1  17.78,12.7 0 top
R2  80.01,62.23 0 top
R3  77.47,68.58 0 top
R4  5.08,12.7 0 top
R5  71.88,56.01 90 top
R6  73.15,79.63 90 top
R7  75.95,79.5 90 top
R8  62.23,77.47 90 top
R9  52.07,48.26 90 top
RESET  17.78,8.89 180 top
RESET_BUTTON  64.77,82.55 180 top
RESETTABLE-FUSE  85.09,68.58 0 top
STM32-BREAKOUT  55.88,30.48 0 top
U1  10.16,29.21 180 top
U$1  30.48,71.12 270 top
U$2  67.31,6.35 0 top
U$3  90.17,5.08 0 bottom
U$4  85.09,5.08 0 bottom
USB  81.28,82.55 90 top
USERBUTTON  64.77,86.36 180 top
VDO  71.12,67.31 0 top
Y1  46.99,46.99 90 top

### Tracks (layer width: path | path; a pad name or v marks a point on that pad's centre or on a via)
BOOT0  (via drill 0.35)
  Top 0.152: 71.91,54.13 71.91,52.86 IC1.60 | 71.91,54.13 71.91,55.09 R5.1 | v71.12,54.13 71.91,54.13 | v43.02,59.69 43.02,30.32 STM32-BREAKOUT.9
  Bottom 0.152: v71.12,54.13 65.56,59.69 v43.02,59.69
CLK
  Top 0.152: U1.20 23.97,29.84 23.97,27.78 25.4,26.35 ESP-BREAKOUT.20
CMD  (via drill 0.35)
  Top 0.152: v23.18,28.58 U1.19
  Bottom 0.152: v23.18,28.58 25.24,26.51 26.83,26.51 ESP-BREAKOUT.19
ESP-EN
  Top 0.152: U1.3 4.92,20.32 4.45,20.8 4.45,21.11 4.29,21.27 1.75,21.27 1.75,14.61 3.65,12.7 R4.1 3.81,12.7 3.81,9.37 4.29,8.89 ENABLE.P$1
ESP-IO0  (via drill 0.35)
  Top 0.152: 19.05,34.13 19.05,21.75 19.68,21.11 19.68,15.88 16.51,12.7 R1.1 16.35,12.7 16.35,10.64 14.61,8.89 RESET.P$1 | 19.05,34.13 19.05,38.1 U1.25 | 19.05,34.13 v18.73,34.13
  Bottom 0.152: ESP-BREAKOUT.25 26.83,34.13 v18.73,34.13
ESP-RX  (1 unrouted)
  Top 0.152: ESP32PH.RX 8.89,48.26
ESP-RX0  (via drill 0.35)  (1 unrouted)
  Top 0.152: U1.34 7.62,38.26 7.62,44.45 8.89,45.72 v10.64,43.97
  Bottom 0.152: ESP-BREAKOUT.34 24.61,43.97 v10.64,43.97
ESP-TX0
  Top 0.152: ESP32PH.TX 4.6,45.72 6.19,44.13 6.19,38.26 U1.35
  Bottom 0.152: ESP-BREAKOUT.35 26.83,46.83 24.92,46.83 23.81,45.72 ESP32PH.TX
ESP_CS  (via drill 0.35)
  Top 0.152: v74.77,54.13 74.93,53.98 74.93,52.86 IC1.54 | v9.37,39.53 9.37,38.73 8.89,38.26 U1.33 | v26.83,49.85 26.83,44.29 ESP-BREAKOUT.33
  Bottom 0.152: M10.1 75.56,53.34 v74.77,54.13 73.5,52.86 31.59,52.86 28.42,49.69 26.99,49.69 v26.83,49.85 | v9.37,39.53 11.91,42.07 26.83,42.07 ESP-BREAKOUT.33
GND  (via drill 0.35)
  Top 0.152: 61.6,83.98 61.6,86.36 USERBUTTON.P$1 | 61.6,83.98 61.6,82.55 RESET_BUTTON.P$1 61.44,82.55 61.28,82.39 61.28,52.71 61.91,52.07 C10.2 62.07,51.91 62.07,43.66 | 75.72,66.04 CHARGING_CIRCUT.2 | 75.72,66.04 75.72,67.79 76.04,68.1 | 76.04,68.1 76.52,68.58 R3.1 | 76.04,68.1 76.04,71.75 75.41,72.39 C3.1 | IC1.63 70.48,52.86 70.48,55.56 71.75,56.83 R5.2 71.75,56.99 71.12,57.63 71.12,63.98 | VDO.7 VDO.2 | 66.52,57.79 66.52,55.88 C9.2 | 73.18,82.55 73.18,82.39 72.23,81.44 72.23,79.53 73.02,78.74 R6.1 | 73.02,76.99 73.02,78.58 R6.1 | 73.02,76.99 73.02,73.34 72.07,72.39 C4.2 71.91,72.39 71.91,68.1 VDO.7 | 66.52,57.79 67.15,58.42 67.15,71.12 73.02,76.99 | 66.52,57.79 C8.2 | VDO.7 71.12,63.98 | 75.72,66.04 73.18,66.04 71.12,63.98 | 61.6,83.98 73.18,83.98 73.18,82.55 | 73.18,82.55 C18.2 | 87.47,20.95 87.47,24.77 86.52,25.72 APA8.3 86.52,25.88 86.52,30.64 M10.9 90.17,34.29 90.17,66.04 | 87.47,20.95 86.68,20.16 C39.2 | 90.49,17.78 90.96,18.26 C32.2 90.49,17.78 | 90.49,17.78 90.01,17.3 90.01,13.34 91.28,12.07 APA9.3 | 87.47,20.95 90.49,17.94 90.49,17.78 | IC1.47 79.38,50.32 78.42,50.32 78.42,52.07 80.49,54.13 C5.2 80.64,54.13 81.91,55.4 81.91,57.47 83.82,59.37 | 83.82,59.37 83.03,60.17 83.03,63.34 | 83.03,63.34 83.03,64.77 C2.2 | 83.82,59.37 C1.2 | 79.53,83.34 78.9,83.34 USB.P$7 | 79.53,83.34 79.85,83.34 USB.GND | USB.P$6 79.53,86.04 77.79,86.04 77.79,86.2 USB.P$11 | 79.53,83.34 79.53,85.88 USB.P$6 | 79.53,83.34 USB.P$7 | 84.93,84.93 90.33,84.93 P1.1 90.49,84.77 91.12,84.14 91.12,66.99 90.17,66.04 | 84.93,84.93 84.93,86.2 USB.P$10 84.77,86.2 84.77,86.04 83.03,86.04 USB.P$8 82.87,86.04 79.69,86.04 USB.P$6
  Top 0.152: 84.93,84.93 84.93,84.46 83.82,83.34 USB.P$9 83.82,83.19 83.82,76.04 CN1.2 | 90.17,66.04 LINK1.GND | v84.14,63.34 83.03,63.34 | R6.1 73.18,78.74 74.14,78.74 75.09,79.69 78.74,79.69 78.74,83.19 USB.P$7 | 79.85,20.8 79.85,24.77 78.9,25.72 APA7.3 | 79.85,20.8 79.06,20 C38.2 78.9,19.84 76.52,19.84 76.52,19.21 75.56,18.26 C34.2 75.41,18.26 71.6,18.26 C37.2 | 82.55,18.1 82.55,13.18 83.66,12.07 APA10.3 | 82.55,18.1 79.85,20.8 | 82.55,18.1 C33.2 | APA11.3 76.04,12.22 71.6,16.67 71.6,18.1 C37.2 | 64.61,20.8 64.61,24.77 63.66,25.72 APA5.3 | 64.61,20.8 63.82,20 C36.2 63.66,19.84 59.85,16.03 | 67.79,17.62 68.26,18.1 C35.2 | 67.79,17.62 67.47,17.3 67.47,13.02 68.42,12.07 APA12.3 | 67.79,17.62 64.61,20.8 | 67.79,17.62 C35.2 | C37.2 71.44,18.26 68.42,18.26 C35.2 | 70.33,43.34 70.33,43.66 68.74,45.24 67.94,45.24 IC1.12 67.79,45.24 65.41,45.24 63.82,43.66 63.5,43.66 | 70.33,43.34 70.33,41.27 IC1.18 | 70.33,43.34 68.58,41.59 68.58,36.99 69.85,36.99 70.48,37.62 C6.2 | 63.5,43.66 62.07,43.66 | 62.07,43.66 59.69,43.66 C12.2 59.69,33.34 58.58,32.23 58.58,27.62 | 63.5,43.66 C11.2 | C7.2 77.15,36.35 76.36,35.56 76.36,29.05 74.77,27.46 74.77,25.88 71.28,25.88 APA6.3 71.12,25.88 69.37,27.62 58.58,27.62 | IC1.31 76.83,41.12 76.83,39.69 76.2,39.05 76.2,37.47 77.15,36.51 C7.2 | C17.2 79.85,36.51 77.31,36.51 C7.2 | C44.2 57.94,2.54 57.31,3.18 57.31,7.62 56.04,8.89 APA17.3 55.88,9.05 52.71,12.22 APA15.3 52.55,12.22 51.59,13.18 51.59,17.14 52.55,18.1 C29.2 52.71,18.26 55.25,18.26 55.25,19.05 56.2,20 C43.2 56.36,20 56.99,20.64 | 59.85,17.62 59.85,16.03 | 59.85,16.03 59.85,13.18 60.8,12.22 APA16.3
  Top 0.152: 59.85,17.62 60.33,18.1 C14.2 59.85,17.62 | 56.67,25.08 56.99,24.77 56.99,20.64 | 56.67,25.08 56.04,25.72 APA4.3 55.88,25.88 53.66,28.1 40.16,28.1 40.16,25.88 APA2.3 | 59.85,17.62 56.99,20.48 56.99,20.64 | 58.58,27.62 56.67,27.62 56.67,25.08 | U$1.GND 2.7,76.36 2.7,61.75 4.76,59.69 7.3,59.69 7.3,52.07 4.76,49.53 2.54,49.53 2.54,44.45 ESP32PH.GND 3.02,42.39 3.02,38.73 2.54,38.26 U1.38 2.54,38.1 2.54,36.83 U1.GND | 9.84,9.84 10.79,8.89 ENABLE.P$2 | 9.84,9.84 8.73,10.95 8.73,13.81 6.03,16.51 C13.2 | 9.84,9.84 9.84,7.94 8.89,7.94 5.4,11.43 5.4,13.02 3.02,15.4 3.02,19.68 2.54,20.16 U1.1 | 34.13,1.43 34.45,1.75 34.45,1.91 35.08,2.54 C47.2 | 34.13,1.43 27.94,1.43 ESP-BREAKOUT.1 29.05,3.65 29.05,5.71 31.91,8.57 APA20.3 31.91,8.73 31.91,8.89 26.51,8.89 | 34.13,1.43 41.75,1.43 42.07,1.75 42.07,1.91 42.7,2.54 C46.2 | 26.51,8.89 RESET.P$2 | 38.26,48.74 38.26,43.66 39.37,43.66 C15.1 | 38.26,48.74 39.37,49.85 C16.1 | 26.51,19.21 27.94,19.21 ESP-BREAKOUT.15 30.96,20.32 30.96,21.11 | 26.51,19.21 24.77,19.21 20.48,23.49 U1.15 20.16,23.49 19.37,24.29 19.37,34.92 U1.24 20.48,34.92 20.48,43.34 ESP-BREAKOUT.38 | v37.94,48.74 38.26,48.74 | C45.2 50.32,2.54 49.69,3.18 49.69,6.98 48.1,8.57 APA18.3 47.94,8.73 44.61,12.07 APA14.3 44.45,12.22 43.66,13.02 43.66,19.05 | APA3.3 47.94,25.72 48.9,24.77 48.9,20.64 48.26,20 C42.2 48.1,19.84 45.56,19.84 45.56,19.05 44.61,18.1 C30.2 44.45,18.26 43.66,19.05 | 40.96,21.75 40.96,20.8 40.32,20.16 C41.2 | 40.96,21.75 40.96,24.92 40.16,25.72 APA2.3 | 40.96,21.75 43.66,19.05 | APA19.3 39.85,8.73 36.83,11.75 36.83,12.07 APA13.3 36.67,12.22 35.72,13.18 35.72,18.41
  Top 0.152: 30.96,21.11 30.96,24.92 31.75,25.72 APA1.3 31.91,25.88 32.86,26.83 | 30.96,21.11 32.07,20 C40.2 32.23,19.84 33.18,18.89 33.18,18.41 35.72,18.41 | 35.72,18.41 36.2,18.41 C31.2 35.72,18.41 | STM32-BREAKOUT.2 32.86,30.64 32.86,26.83 | 32.86,26.83 37.15,26.83 37.62,26.35 37.62,25.88 40.01,25.88 APA2.3 | 26.51,19.21 26.51,8.89
  Bottom 0.152: v84.14,63.34 85.57,64.77 LINK1.GND | ENABLE.P$2 10.95,8.89 12.38,7.46 19.53,7.46 20.95,8.89 RESET.P$2 | v37.94,48.74 37.31,49.37 29.05,49.37 | 29.05,49.37 27.3,49.37 26.19,48.26 ESP-BREAKOUT.38 | ESP-BREAKOUT.24 26.51,31.59 31.59,31.59 STM32-BREAKOUT.2 | ESP32PH.GND 8.89,43.18 10.32,44.61 28.42,44.61 29.05,45.24 29.05,49.37
GPIO_APA104_DATA  (via drill 0.35)
  Top 0.152: v35.08,25.88 35.08,25.72 31.91,22.54 APA1.4 | v76.68,51.44 76.68,47.31 79.38,47.31 IC1.41 | v50.8,51.59 49.21,50.01 49.21,32.07 STM32-BREAKOUT.16
  Bottom 0.152: v35.08,25.88 38.26,29.05 38.26,30.32 48.1,30.32 STM32-BREAKOUT.16 | v76.68,51.44 76.52,51.59 v50.8,51.59
IO4  (via drill 0.35)
  Top 0.152: v17.78,34.13 17.78,38.1 U1.26
  Bottom 0.152: v17.78,34.13 18.89,33.02 ESP-BREAKOUT.26
IO5
  Top 0.152: ESP-BREAKOUT.29 26.51,39.53 26.51,48.74 26.35,48.9 26.35,49.37 24.77,49.37 14.45,39.05 14.45,38.73 13.97,38.26 U1.29
IO14  (via drill 0.35)
  Top 0.152: v18.1,18.89 18.1,19.84 17.78,20.16 U1.13
  Bottom 0.152: v18.1,18.89 20.32,16.67 26.83,16.67 ESP-BREAKOUT.13
IO16  (via drill 0.35)
  Top 0.152: v16.99,36.83 16.99,37.62 16.51,38.1 U1.27
  Bottom 0.152: v16.99,36.83 17.14,36.67 26.83,36.67 ESP-BREAKOUT.27
IO17  (via drill 0.35)
  Top 0.152: v15.72,36.35 15.72,37.62 15.24,38.1 U1.28
  Bottom 0.152: v15.72,36.35 16.51,35.56 ESP-BREAKOUT.28
IO18  (via drill 0.35)
  Top 0.152: v13.18,36.83 13.18,37.62 12.7,38.1 U1.30
  Bottom 0.152: v13.18,36.83 14.45,38.1 ESP-BREAKOUT.30
IO19
  Top 0.152: ESP-BREAKOUT.31 29.05,41.75 29.05,51.91 24.77,51.91 11.91,39.05 11.91,38.73 11.43,38.26 U1.31
IO22  (via drill 0.35)
  Top 0.152: v5.56,43.81 5.56,38.73 5.08,38.26 U1.36
  Bottom 0.152: v5.56,43.81 7.14,45.4 25.08,45.4 ESP-BREAKOUT.36
IO23  (via drill 0.35)
  Top 0.152: v3.65,41.59 3.65,38.26 U1.37
  Bottom 0.152: v3.65,41.59 2.54,42.7 2.54,46.99 24.61,46.99 24.77,47.15 26.83,47.15 ESP-BREAKOUT.37
IO25  (via drill 0.35)
  Top 0.152: v14.45,16.67 14.45,19.68 13.97,20.16 U1.10
  Bottom 0.152: v14.45,16.67 18.41,12.7 ESP-BREAKOUT.10
IO26  (via drill 0.35)
  Top 0.152: v15.72,18.89 15.72,19.68 15.24,20.16 U1.11
  Bottom 0.152: v15.72,18.89 17.14,17.46 19.05,17.46 20.16,16.35 26.83,16.35 ESP-BREAKOUT.11
IO27  (via drill 0.35)
  Top 0.152: v16.99,16.83 16.99,19.68 16.51,20.16 U1.12
  Bottom 0.152: v16.99,16.83 18.57,15.24 ESP-BREAKOUT.12
IO32  (via drill 0.35)
  Top 0.152: v11.91,16.67 11.91,19.68 11.43,20.16 U1.8
  Bottom 0.152: v11.91,16.67 17.94,10.64 24.92,10.64 ESP-BREAKOUT.8
IO33  (via drill 0.35)
  Top 0.152: v13.18,18.89 13.18,19.68 12.7,20.16 U1.9
  Bottom 0.152: v13.18,18.89 18.26,13.81 26.83,13.81 ESP-BREAKOUT.9
IO34
  Top 0.152: ESP-BREAKOUT.6 26.51,6.51 26.51,1.43 20,1.43 13.18,8.25 13.18,9.05 9.37,12.86 9.37,19.68 8.89,20.16 U1.6
IO35  (via drill 0.35)
  Top 0.152: v10.64,18.89 10.64,19.68 10.16,20.16 U1.7
  Bottom 0.152: v10.64,18.89 18.26,11.27 26.83,11.27 ESP-BREAKOUT.7
LCD_BACKLIGHT  (via drill 0.35)
  Top 0.152: v75.56,33.18 75.41,33.34 75.41,41.12 IC1.28 | v49.85,53.5 53.98,49.37 v53.98,35.08
  Bottom 0.152: v75.56,33.18 75.25,32.86 73.5,32.86 | STM32-BREAKOUT.34 73.5,32.86 | U$1.LED 12.54,53.5 v49.85,53.5 | v53.98,35.08 56.2,32.86 73.5,32.86
LCD_CS  (via drill 0.35)
  Top 0.152: v69.21,46.35 69.21,46.67 67.94,46.67 IC1.9 | v52.55,42.55 v50.64,40.64 50.64,30.32 STM32-BREAKOUT.15
  Bottom 0.152: v69.21,46.35 56.36,46.35 v52.55,42.55 | U$1.CS 1.75,72.87 1.75,38.89 24.61,38.89 25.24,39.53 37.15,39.53 38.26,40.64 v50.64,40.64
LCD_DATA_CMD  (via drill 0.35)
  Top 0.152: v70.01,48.9 70.01,47.31 67.94,47.31 IC1.8 | 49.21,50.96 48.1,49.85 48.1,30.32 STM32-BREAKOUT.13 | 49.21,50.96 v49.53,51.28 | 49.21,50.96 v43.82,56.36
  Bottom 0.152: v70.01,48.9 70.01,51.12 51.28,51.12 51.12,50.96 49.85,50.96 v49.53,51.28 | U$1.A0 17.3,56.36 v43.82,56.36
LCD_RESET  (via drill 0.35)
  Top 0.152: v73.98,35.08 73.98,41.12 IC1.25
  Bottom 0.152: v73.98,35.08 74.3,34.77 76.99,34.77 79.22,32.54 | STM32-BREAKOUT.40 79.22,32.54 | U$1.RESET 5.24,73.82 63.18,73.82 82.39,54.61 89.38,54.61 90.8,53.18 90.8,31.75 82.87,31.75 82.07,32.54 79.22,32.54
N$1  (via drill 0.35)
  Top 0.152: v78.9,63.5 78.9,62.39 79.06,62.23 R2.1 | v74.61,63.34 73.5,62.23 LED1.A
  Bottom 0.152: v78.9,63.5 78.74,63.34 v74.61,63.34
N$2
  Top 0.152: CHARGING_CIRCUT.5 78.42,66.99 78.42,68.58 R3.2
N$3  (via drill 0.35)
  Top 0.152: v77.47,67.15 77.47,66.99 76.52,66.99 CHARGING_CIRCUT.1 | v76.83,63.98 76.52,63.66 76.52,62.23 LED1.C
  Bottom 0.152: v77.47,67.15 76.83,66.52 v76.83,63.98
N$4
  Top 0.152: R6.2 73.18,80.65 74.14,81.6 74.14,85.57 73.34,86.36 C19.2
N$5
  Top 0.152: APA1.2 36.83,25.72 40.01,22.54 APA2.4
N$7
  Top 0.152: APA3.4 47.78,22.7 44.93,25.56 44.93,25.72 APA2.2
N$8
  Top 0.152: APA4.4 55.88,22.54 52.71,25.72 APA3.2
N$9
  Top 0.152: APA6.4 71.12,22.54 68.58,25.08 68.58,25.72 APA5.2
N$10
  Top 0.152: APA7.4 78.74,22.54 76.2,25.08 76.2,25.72 APA6.2
N$11
  Top 0.152: APA8.4 86.36,22.54 83.82,25.08 83.82,25.72 APA7.2
N$12
  Top 0.152: APA10.4 83.82,15.08 86.36,12.54 86.36,12.07 APA9.2
N$13
  Top 0.152: APA11.4 76.2,15.24 78.74,12.7 78.74,12.07 APA10.2
N$14
  Top 0.152: APA12.4 68.58,15.08 71.12,12.54 71.12,12.22 APA11.2
N$15
  Top 0.152: APA15.4 52.71,15.24 55.88,12.07 APA16.2
N$16
  Top 0.152: APA14.4 44.61,15.24 47.62,12.22 APA15.2
N$17
  Top 0.152: APA13.4 36.83,15.24 39.69,12.38 39.69,12.22 APA14.2
N$18
  Top 0.152: APA20.2 36.83,8.57 39.85,5.56 39.85,5.4 APA19.4
N$19
  Top 0.152: APA18.4 47.94,5.56 44.77,8.73 APA19.2
N$20  (via drill 0.35)
  Top 0.152: v76.83,42.55 76.52,42.23 76.52,41.27 IC1.30 | v79.85,41.43 79.85,38.26 C17.1
  Bottom 0.152: v76.83,42.55 77.95,41.43 v79.85,41.43
N$21
  Top 0.152: APA17.4 55.88,5.87 53.18,8.57 52.86,8.57 APA18.2
N$22
  Top 0.152: APA5.4 63.5,22.54 60.96,25.08 60.96,25.72 APA4.2
N$23
  Top 0.152: APA9.4 91.44,15.24 92.39,16.19 92.39,24.77 91.44,25.72 APA8.2
N$24
  Top 0.152: APA16.4 60.96,15.24 63.5,12.7 63.5,12.07 APA12.2
N$25
  Top 0.152: APA20.4 32.07,5.4 33.02,6.35 33.02,10.95 31.91,12.07 APA13.2
NRST  (via drill 0.35)
  Top 0.152: IC1.7 67.79,47.78 65.25,47.78 v65.25,52.23 65.25,75.25 62.23,78.26 R8.2 62.23,78.42 66.36,82.55 RESET_BUTTON.P$2 C18.1 | STM32-BREAKOUT.11 45.88,30.64 v45.88,51.28
  Bottom 0.152: v45.88,51.28 46.83,52.23 v65.25,52.23
OSC_IN  (via drill 0.35)
  Top 0.152: v49.85,49.21 52.07,49.21 R9.2 | v65.88,48.9 65.88,48.74 67.79,48.74 IC1.5 | v40.8,49.37 40.8,51.59 39.37,51.59 C16.2
  Bottom 0.152: 46.99,49.37 49.69,49.37 v49.85,49.21 65.56,49.21 v65.88,48.9 | 46.99,49.37 v40.8,49.37 | 46.99,49.37 Y1.2
OSC_OUT  (via drill 0.35)
  Top 0.152: v49.85,47.31 52.07,47.31 R9.1 | v69.21,48.26 67.94,48.26 IC1.6 | v40.8,45.24 39.37,45.24 C15.2
  Bottom 0.152: 46.99,44.61 47.15,44.61 v49.85,47.31 51.12,48.58 55.25,48.58 55.56,48.26 v69.21,48.26 | v40.8,45.24 41.43,44.61 46.99,44.61 | 46.99,44.61 Y1.1
PA0
  Top 0.152: STM32-BREAKOUT.23 60.8,30.32 60.8,35.24 64.61,39.05 64.61,43.97 66.36,43.97 66.52,44.13 67.79,44.13 IC1.14
PA1
  Top 0.152: STM32-BREAKOUT.25 63.34,30.32 63.34,31.91 65.56,34.13 65.56,43.66 67.79,43.66 IC1.15
PA2
  Top 0.152: STM32-BREAKOUT.27 65.88,30.32 65.88,43.18 67.79,43.18 IC1.16
PA3  (via drill 0.35)
  Top 0.152: v69.21,41.27 69.85,41.27 IC1.17 | v67.31,41.27 66.2,40.16 66.2,30.32 STM32-BREAKOUT.29
  Bottom 0.152: v67.31,41.27 v69.21,41.27
PA4
  Top 0.152: STM32-BREAKOUT.31 70.96,30.32 70.96,31.91 71.6,32.54 71.6,40.16 71.44,40.32 71.44,41.12 IC1.20
PA5
  Top 0.152: STM32-BREAKOUT.33 73.5,30.32 73.5,32.23 71.91,33.81 71.91,41.12 IC1.21
PA6
  Top 0.152: STM32-BREAKOUT.35 73.82,30.32 73.82,32.38 73.34,32.86 73.34,39.53 72.39,40.48 72.39,41.12 IC1.22
PA7  (via drill 0.35)
  Top 0.152: v72.87,43.81 72.87,41.27 IC1.23 | v82.39,43.66 82.39,31.59 81.12,30.32 77.47,30.32 STM32-BREAKOUT.37
  Bottom 0.152: v72.87,43.81 73.98,44.93 81.12,44.93 v82.39,43.66
PA15  (via drill 0.35)
  Top 0.152: v76.99,54.13 76.99,52.86 IC1.50 | v43.66,60.48 42.39,60.48 42.39,51.44 42.7,51.12 42.7,32.54 STM32-BREAKOUT.10
  Bottom 0.152: v76.99,54.13 70.64,60.48 v43.66,60.48
PB0  (via drill 0.35)
  Top 0.152: v74.3,34.13 74.61,34.45 74.61,35.4 74.45,35.56 74.45,41.12 IC1.26
  Bottom 0.152: v74.3,34.13 74.61,33.81 75.88,33.81 77.47,32.23 STM32-BREAKOUT.38
PB1
  Top 0.152: STM32-BREAKOUT.36 74.93,41.12 IC1.27
PB3  (via drill 0.35)
  Top 0.152: v75.56,50.8 74.45,51.91 74.45,52.71 IC1.55
  Bottom 0.152: M10.2 v75.56,50.8
PB4  (via drill 0.35)
  Top 0.152: v76.04,48.26 73.82,50.48 73.82,52.71 IC1.56
  Bottom 0.152: M10.3 v76.04,48.26
PB5  (via drill 0.35)
  Top 0.152: v73.5,46.67 73.5,52.55 73.34,52.71 IC1.57
  Bottom 0.152: v73.5,46.67 73.82,46.99 85.72,46.99 86.99,45.72 M10.4
PB6  (via drill 0.35)
  Top 0.152: v72.55,48.74 72.87,49.05 72.87,52.71 IC1.58 | v86.52,47.62 87.63,46.51 87.63,44.45 M10.5
  Bottom 0.152: v72.55,48.74 73.66,47.62 v86.52,47.62
PB7  (via drill 0.35)
  Top 0.152: v72.23,50.01 72.39,50.16 72.39,52.71 IC1.59 | v83.98,48.9 87.31,45.56 87.31,42.23 M10.6
  Bottom 0.152: v72.23,50.01 73.34,48.9 v83.98,48.9
PB8  (via drill 0.35)
  Top 0.152: v71.44,48.74 71.44,52.71 IC1.61
  Bottom 0.152: v71.44,48.74 72.87,47.31 85.88,47.31 86.2,46.99 89.38,46.99 90.17,46.2 90.17,38.1 M10.7
PB9  (via drill 0.35)
  Top 0.152: v70.8,50.96 70.8,52.71 IC1.62
  Bottom 0.152: v70.8,50.96 71.12,50.64 73.66,50.64 74.77,49.53 89.38,49.53 90.49,48.42 90.49,35.56 M10.8
PB13  (via drill 0.35)
  Top 0.152: v80.49,40.64 80.49,43.66 79.53,43.66 IC1.34 | v59.05,40.64 58.42,40.01 58.42,32.54 58.26,32.38 58.26,30.32 STM32-BREAKOUT.21
  Bottom 0.152: v59.05,40.64 v80.49,40.64
PB14  (via drill 0.35)
  Top 0.152: v80.8,44.29 79.53,44.29 IC1.35 | v67.31,42.55 67.94,41.91 67.94,32.7 68.42,32.23 68.42,28.73 67.79,28.1 63.66,28.1 63.66,30.64 STM32-BREAKOUT.28
  Bottom 0.152: v80.8,44.29 79.69,43.18 67.94,43.18 v67.31,42.55
PB15  (via drill 0.35)
  Top 0.152: v78.58,38.58 78.58,39.69 78.42,39.85 78.42,44.77 79.38,44.77 IC1.36 | v64.93,38.42 62.23,35.72 STM32-BREAKOUT.26
  Bottom 0.152: v78.58,38.58 78.42,38.42 v64.93,38.42
PC2  (via drill 0.35)
  Top 0.152: v65.72,46.99 65.72,46.35 67.79,46.35 IC1.10 | v53.34,46.67 53.18,46.51 53.18,30.32 STM32-BREAKOUT.17
  Bottom 0.152: v65.72,46.99 65.41,46.67 v53.34,46.67
PC6  (via drill 0.35)
  Top 0.152: v81.76,31.91 81.76,45.24 79.53,45.24 IC1.37
  Bottom 0.152: v81.76,31.91 80.49,30.64 60.8,30.64 STM32-BREAKOUT.24
PC7  (via drill 0.35)
  Top 0.152: v82.07,30.32 83.03,31.27 83.03,45.72 79.53,45.72 IC1.38
  Bottom 0.152: v82.07,30.32 58.58,30.32 STM32-BREAKOUT.22
PC8  (via drill 0.35)
  Top 0.152: v78.1,46.2 79.38,46.2 IC1.39 | v54.93,47.94 54.61,47.62 STM32-BREAKOUT.20
  Bottom 0.152: v78.1,46.2 77.95,46.04 70.48,46.04 68.58,47.94 v54.93,47.94
PC9  (via drill 0.35)
  Top 0.152: v77.95,39.37 77.95,42.07 77.47,42.55 77.47,46.83 79.38,46.83 IC1.40 | v52.55,39.05 52.07,38.58 STM32-BREAKOUT.18
  Bottom 0.152: v77.95,39.37 77.63,39.05 v52.55,39.05
PC10  (via drill 0.35)
  Top 0.152: v76.52,55.56 76.36,55.4 76.36,52.86 IC1.51 | v42.55,61.12 42.07,60.64 42.07,51.28 42.39,50.96 42.39,34.77 STM32-BREAKOUT.8
  Bottom 0.152: v76.52,55.56 70.96,61.12 v42.55,61.12
PC13  (via drill 0.35)
  Top 0.152: R7.2 75.88,80.49 74.45,81.91 74.45,87 73.98,87.47 71.6,87.47 71.6,86.36 C19.1 USERBUTTON.P$2 | v65.56,80.8 65.56,54.77 66.52,53.82 66.52,50.32 67.79,50.32 IC1.2 | STM32-BREAKOUT.3 35.72,30.64 35.72,56.67 v54.77,75.72
  Bottom 0.152: USERBUTTON.P$2 65.56,86.36 v65.56,80.8 59.85,80.8 v54.77,75.72
PC14  (via drill 0.35)
  Top 0.152: v69.21,49.53 69.21,49.69 67.94,49.69 IC1.3 | v40.48,42.55 37.94,40.01 37.94,30.32 STM32-BREAKOUT.5
  Bottom 0.152: v69.21,49.53 68.9,49.85 47.78,49.85 47.31,50.32 42.39,50.32 42.07,50.01 40.48,50.01 40.16,49.69 40.16,42.55 v40.48,42.55
PC15  (via drill 0.35)
  Top 0.152: v65.88,50.48 66.52,49.85 66.52,49.21 67.79,49.21 IC1.4 | v41.75,50.64 41.43,50.32 41.43,35.4 38.26,32.23 38.26,30.32 STM32-BREAKOUT.7
  Bottom 0.152: v65.88,50.48 65.72,50.64 v41.75,50.64
SD1
  Top 0.152: U1.22 23.97,32.38 23.97,30.32 25.4,28.89 ESP-BREAKOUT.22
SD2
  Top 0.152: U1.17 23.65,26.04 23.65,25.08 24.77,23.97 27.94,23.97 ESP-BREAKOUT.17
SD3
  Top 0.152: U1.18 23.97,27.3 23.97,25.24 24.92,24.29 29.05,24.29 29.05,22.38 28.42,21.75 25.4,21.75 ESP-BREAKOUT.18
SD_CS  (via drill 0.35)
  Top 0.152: v73.5,45.4 73.5,41.27 IC1.24 | U$1.SD_CS 53.66,71.44 53.66,55.88 56.67,52.86 56.67,44.77 v57.47,43.97 56.04,42.55 56.04,28.26 v56.2,28.1
  Bottom 0.152: v73.5,45.4 72.07,43.97 v57.47,43.97 | STM32-BREAKOUT.39 78.9,28.1 v56.2,28.1
SDO  (via drill 0.35)
  Top 0.152: v23.18,31.12 U1.21
  Bottom 0.152: v23.18,31.12 25.24,29.05 26.83,29.05 ESP-BREAKOUT.21
SENSOR_VN  (via drill 0.35)
  Top 0.152: v8.1,18.89 8.1,19.68 7.62,20.16 U1.5
  Bottom 0.152: v8.1,18.89 16.67,10.32 23.65,10.32 25.24,8.73 26.83,8.73 ESP-BREAKOUT.5
SENSOR_VP  (via drill 0.35)
  Top 0.152: v12.86,6.83 12.86,8.89 9.05,12.7 9.05,13.97 6.83,16.19 6.83,19.68 6.35,20.16 U1.4
  Bottom 0.152: v12.86,6.83 14.61,5.08 ESP-BREAKOUT.4
SPI2_LCD_MOSI  (via drill 0.35)
  Top 0.152: v64.29,47.31 65.56,46.04 65.56,45.72 67.79,45.72 IC1.11 | STM32-BREAKOUT.19 55.72,30.32 55.72,46.99 v56.04,47.31 56.04,48.26 v48.58,55.72
  Bottom 0.152: v56.04,47.31 v64.29,47.31 | U$1.SDA 15.4,55.72 v48.58,55.72
SPI2_LCD_SCK  (via drill 0.35)
  Top 0.152: v75.88,42.55 75.88,41.27 IC1.29 | v68.42,42.39 68.26,42.23 68.26,33.34 STM32-BREAKOUT.32 | U$1.SCK 16.35,52.23 33.02,52.23 v33.02,48.74
  Bottom 0.152: v75.88,42.55 75.72,42.39 v68.42,42.39 67.94,41.91 39.85,41.91 v33.02,48.74
SPI3_ESP_MISO  (via drill 0.35)
  Top 0.152: U1.16 23.5,24.77 23.5,22.23 ESP-BREAKOUT.16 | v75.88,58.1 75.88,52.86 IC1.52 | STM32-BREAKOUT.6 37.31,32.23 37.31,56.83 v53.66,73.18
  Bottom 0.152: STM32-BREAKOUT.6 35.72,30.64 32.7,30.64 32.38,30.32 31.27,30.32 29.37,28.42 29.37,21.43 26.51,21.43 ESP-BREAKOUT.16 | v75.88,58.1 64.14,69.85 61.28,69.85 | U$1.SD_MISO 61.28,69.85 | v53.66,73.18 53.98,73.5 57.63,73.5 61.28,69.85
SPI3_ESP_MOSI  (via drill 0.35)
  Top 0.152: v19.05,18.89 19.05,20.16 U1.14 | v71.75,61.28 75.41,57.63 75.41,52.86 IC1.53 | STM32-BREAKOUT.4 35.4,32.86 35.4,57.31 54.45,76.36 58.26,76.36 58.26,73.5 U$1.SD_MOSI
  Bottom 0.152: v19.05,18.89 20.16,17.78 21.27,17.78 | ESP-BREAKOUT.14 21.27,17.78 | STM32-BREAKOUT.4 33.5,30.96 32.54,30.96 32.23,30.64 31.11,30.64 29.05,28.58 29.05,21.75 25.24,21.75 21.27,17.78 | v71.75,61.28 64.29,68.74 56.67,68.74 56.04,69.37 56.04,72.39 U$1.SD_MOSI
SPI3_ESP_SCK  (via drill 0.35)
  Top 0.152: U1.23 24.29,33.66 24.29,32.54 25.24,31.59 27.94,31.59 | ESP-BREAKOUT.23 27.94,31.59 | v79.22,39.37 79.22,43.02 79.38,43.18 IC1.33 | STM32-BREAKOUT.30 v67.31,36.67 | U$1.SD_SCK 59.21,65.25 59.21,46.67 58.1,45.56 v58.1,40.64 | 27.94,31.59 30.32,31.59 v30.32,32.23
  Bottom 0.152: v67.31,36.67 79.22,36.67 v79.22,39.37 78.58,40.01 58.74,40.01 | 58.74,40.01 v58.1,40.64 | v30.32,32.23 38.1,40.01 58.74,40.01
SYS_JTCK_SWCLK  (via drill 0.35)
  Top 0.152: v77.63,62.23 77.63,53.02 77.47,52.86 IC1.49
  Bottom 0.152: LINK1.SWDCLK v77.63,62.23
SYS_JTMS_SWDIO  (via drill 0.35)
  Top 0.152: v81.91,51.44 81.91,49.85 79.53,49.85 IC1.46 | v83.98,52.71 87.63,56.36 87.63,58.42 LINK1.SWDIO
  Bottom 0.152: v81.91,51.44 83.19,52.71 v83.98,52.71
USART1_RX  (via drill 0.35)
  Top 0.152: v81.76,46.35 81.76,48.26 79.53,48.26 IC1.43
  Bottom 0.152: v81.76,46.35 81.76,45.88 83.34,44.29 83.34,35.72 48.42,35.72 STM32-BREAKOUT.12
USART1_TX  (via drill 0.35)
  Top 0.152: v80.8,46.35 80.8,47.62 79.53,47.62 IC1.42
  Bottom 0.152: v80.8,46.35 83.03,44.13 83.03,36.04 47.15,36.04 43.34,32.23 43.34,30.64 45.88,30.64 STM32-BREAKOUT.14
USB_DM  (via drill 0.35)
  Top 0.152: v82.55,56.36 82.55,48.74 79.53,48.74 IC1.44 | v80.33,71.12 80.64,71.44 80.64,81.6 81.28,82.23 81.28,83.19 USB.D+
  Bottom 0.152: v82.55,56.36 76.99,61.91 76.99,62.87 79.22,62.87 82.71,66.36 82.71,71.12 v80.33,71.12
USB_DP
  Top 0.152: IC1.45 79.38,49.21 78.1,49.21 78.1,61.75 78.26,61.91 78.26,64.13 77.79,64.61 77.79,65.56 78.58,66.36 80.96,66.36 80.96,81.28 81.91,82.23 81.91,83.19 USB.D-
VCC  (via drill 0.35)
  Top 0.152: U1.2 3.81,20.16 4.13,19.84 4.13,16.51 C13.1 4.29,16.51 4.29,14.76 6.35,12.7 R4.2 6.51,12.7 9.21,10 v9.21,8.57 | ESP-BREAKOUT.2 19.68,8.25 19.68,12.22 19.21,12.7 R1.2 | U$1.VCC 1.75,77.95 1.75,52.86 | 63.66,73.34 63.66,52.07 C10.1 | 63.66,73.34 63.66,75.09 62.23,76.52 R8.1 | IC1.32 77.31,41.12 77.31,38.26 C7.1 77.31,38.1 78.1,38.1 v78.58,37.62 | v63.02,38.42 63.02,39.53 60.64,41.91 FB1.1 | v69.21,37.78 69.53,38.1 69.53,38.42 70.48,39.37 C6.1 70.64,39.37 70.8,39.53 70.8,41.12 IC1.19 70.8,41.27 70.8,49.21 68.58,51.44 | C5.1 80.49,52.23 80.49,51.75 79.53,50.8 IC1.48 79.38,50.8 79.06,51.12 v79.06,51.44 | 69.37,52.23 69.85,52.71 IC1.64 69.85,52.86 68.26,54.45 68.26,55.72 C9.1 68.26,55.88 68.26,57.79 | 69.37,52.23 68.58,51.44 | 68.58,51.44 67.94,50.8 IC1.1 | 69.37,52.23 v69.21,52.23 | VDO.4 72.71,66.36 74.45,68.1 v74.45,73.66 74.45,77.15 75.88,78.58 R7.1 | 70.01,72.23 68.26,70.49 68.26,57.79 | 70.01,72.23 70.17,72.39 C4.1 70.01,72.23 | 68.26,57.79 C8.1 | 70.01,72.23 v71.28,70.96 | v64.61,73.34 63.66,73.34
  Bottom 0.152: 31.75,25.24 31.75,3.65 26.51,3.65 ESP-BREAKOUT.2 15.24,2.54 v9.21,8.57 | 31.75,25.24 STM32-BREAKOUT.1 32.86,30.32 36.99,30.32 38.26,31.59 38.26,38.42 v63.02,38.42 63.66,37.78 v69.21,37.78 78.42,37.78 v78.58,37.62 | M10.10 83.66,25.24 31.75,25.24 | v79.06,51.44 78.26,52.23 v69.21,52.23 | v74.45,73.66 71.75,70.96 v71.28,70.96 66.99,70.96 v64.61,73.34 61.91,76.04 56.67,76.04 55.72,75.09 8.73,75.09 U$1.VCC
VCC0  (via drill 0.35)
  Top 0.152: R2.2 80.8,62.23 80.8,62.87 78.58,65.09 CHARGING_CIRCUT.4 78.58,65.25 78.58,65.88 81.28,65.88 | 81.28,65.88 83.66,65.88 83.98,65.56 83.98,65.41 84.61,64.77 C2.1 84.77,64.77 v84.77,61.28 | 81.28,65.88 81.28,76.52 82.55,77.79 82.55,83.19 USB.+5V
VCC1  (via drill 0.35)
  Top 0.152: APA1.1 36.67,22.38 36.35,22.07 36.35,20.16 C31.1 36.35,20 39.21,20 39.21,19.21 40.16,18.26 | 40.16,18.26 40.16,15.72 39.85,15.4 APA14.1 39.85,15.24 41.12,13.97 41.12,5.24 | 40.16,18.26 C41.1 | 41.12,5.24 44.61,5.24 APA19.1 44.77,5.24 44.77,2.54 C45.1 48.74,2.54 49.37,1.91 49.37,1.75 49.69,1.43 56.36,1.43 | 41.12,4.6 41.12,2.54 C46.1 | 41.12,4.6 41.12,5.24 | C40.1 32.07,18.1 32.07,15.56 31.91,15.4 APA13.1 31.91,15.24 33.5,13.65 33.5,5.24 | 33.5,5.24 36.67,5.24 APA20.1 36.83,5.24 36.83,4.6 41.12,4.6 | 33.5,5.24 33.5,2.54 C47.1 | C30.1 44.61,20 44.61,22.38 44.77,22.54 APA2.1 44.77,22.7 43.82,23.65 43.82,26.35 44.13,26.67 49.21,26.67 49.21,19.84 | APA3.1 52.71,22.54 52.71,20 C29.1 52.55,19.84 49.21,19.84 | 49.21,19.84 49.21,19.21 48.26,18.26 C42.1 48.1,18.1 48.1,15.72 47.78,15.4 APA15.1 47.78,15.24 51.91,11.11 51.91,6.35 52.71,5.56 APA18.1 52.86,5.4 55.72,2.54 C44.1 56.36,2.54 56.36,1.43 | C36.1 63.66,18.1 63.66,15.24 APA12.1 63.66,15.08 64.61,14.13 64.61,11.43 | C43.1 56.2,18.1 56.2,15.56 56.04,15.4 APA16.1 56.04,15.24 59.69,11.59 59.69,11.27 | 59.69,4.76 58.9,3.97 58.9,1.59 58.74,1.43 56.36,1.43 | 59.69,4.76 60.64,5.71 APA17.1 | 59.69,4.76 59.69,11.27 | 64.61,11.43 64.45,11.27 59.69,11.27 | v77.47,66.2 77.47,65.25 76.52,65.25 CHARGING_CIRCUT.3 | 83.19,68.1 83.66,68.58 RESETTABLE-FUSE.1 83.82,68.58 83.82,73.82 CN1.1 | 83.19,68.1 v82.07,66.99 | 83.19,68.1 85.57,65.72 85.57,57.63 83.82,57.63 C1.1 83.82,57.47 83.34,56.99 83.34,27.15 82.71,26.51 | C14.1 60.33,21.91 60.8,22.38 APA4.1 60.8,22.54 59.85,23.49 59.85,26.35 60.01,26.51 67.47,26.51 67.47,23.49 68.42,22.54 APA5.1 68.42,22.38 68.42,20 C35.1 68.42,19.84 71.44,19.84 C37.1 71.6,19.84 75.41,19.84 C34.1 75.56,20 75.56,21.91 76.04,22.38 APA6.1 76.04,22.54 75.09,23.49 75.09,26.35 75.25,26.51 82.71,26.51
  Top 0.152: C38.1 78.9,18.1 78.9,15.24 APA10.1 78.9,15.08 79.85,14.13 79.85,11.27 | 72.23,14.29 75.25,11.27 79.85,11.27 | 72.23,14.29 71.28,15.24 APA11.1 | 82.71,21.43 82.55,21.27 C33.1 82.55,19.84 85.57,19.84 85.57,19.21 86.52,18.26 | 82.71,21.43 83.66,22.38 APA7.1 | APA8.1 91.28,22.38 91.12,22.23 91.12,20.16 C32.1 91.12,20 92.08,19.05 92.08,17.46 90.33,15.72 90.33,14.45 92.23,12.54 92.23,11.43 92.08,11.27 87.47,11.27 | 86.52,18.26 86.52,15.24 APA9.1 86.52,15.08 87.47,14.13 87.47,11.27 | 86.52,18.26 C39.1 | 87.47,11.27 79.85,11.27 | 82.71,21.43 82.71,26.51 | 64.61,11.43 67.47,11.43 67.63,11.27 72.23,11.27 72.23,14.29
  Bottom 0.152: v77.47,66.2 78.26,66.99 v82.07,66.99
VDDA  (via drill 0.35)
  Top 0.152: 59.69,45.4 58.58,44.29 58.58,42.07 58.74,41.91 FB1.2 | v66.04,44.61 66.04,44.77 67.79,44.77 IC1.13 | v64.93,45.72 63.5,45.72 C11.1 | v61.44,45.4 59.69,45.4 | 59.69,45.4 C12.1
  Bottom 0.152: v66.04,44.61 v64.93,45.72 61.75,45.72 v61.44,45.4
VIN  (via drill 0.35)  (2 unrouted)
  Top 0.152: VDO.6 72.71,68.26 73.82,69.37 73.82,77.95 75.25,79.38 76.99,79.38 76.99,72.39 C3.2 v80.01,72.39 | P1.2 90.33,82.71 86.84,82.71 v86.84,72.39 86.84,68.9 86.52,68.58 RESETTABLE-FUSE.2
  Bottom 0.152: v86.84,72.39 v80.01,72.39
VIN-EN  (via drill 0.35)
  Top 0.152: v85.88,83.82 P1.C | v70.48,69.22 69.69,68.42 69.69,68.26 VDO.1
  Bottom 0.152: v85.88,83.82 71.28,69.22 v70.48,69.22